# EasyEDA Pro project ATLAS.epro

# Schematic Atlas

## Sheets
1 Sheet_1: Board Name: Atlas; Create Date: 2026-04-08; Page Name: Sheet_1; Project Name: Atlas_2026-04-08_17-02-08; Schematic Name: Atlas; Update Date: 2026-04-08; Add into BOM: yes; Company: Your Company; Convert to PCB: yes; Date: 2026-01-27; Draw By: aryan17550; REV: 1.0; Sheet: 1/1; spicePre: .
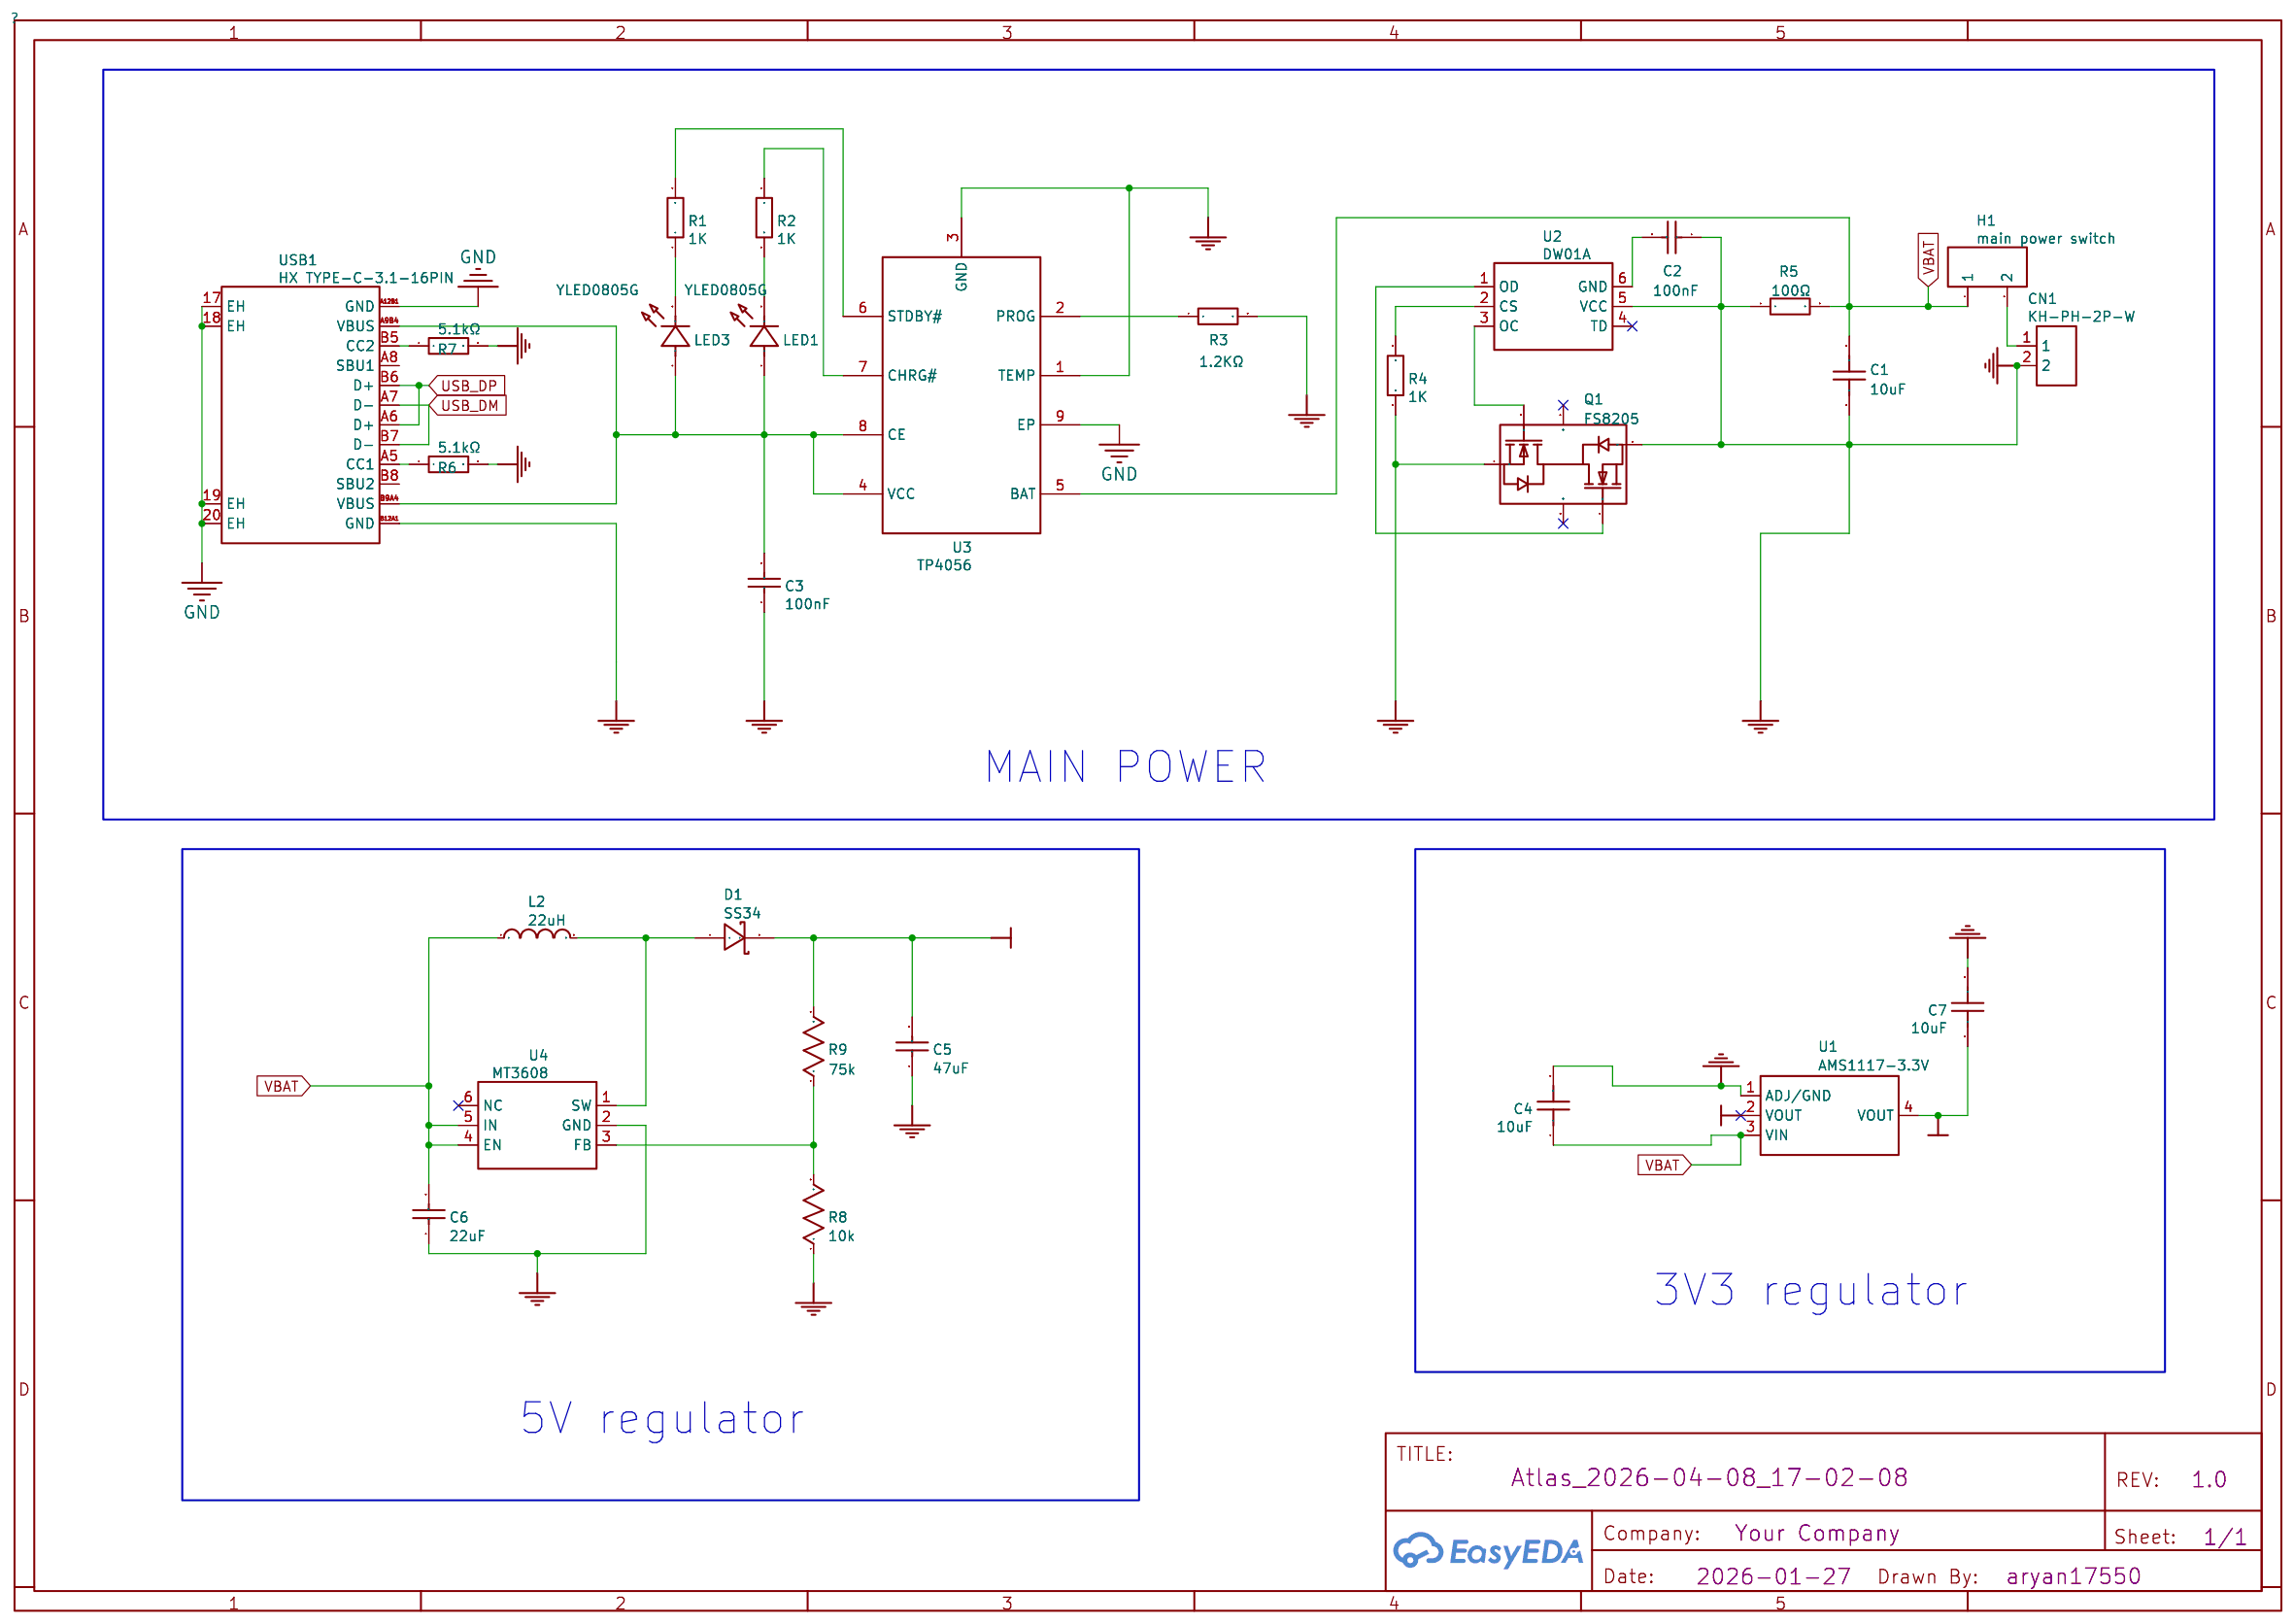
[diagram p0: Sheet_1]
2 Sheet_2: Page Name: Sheet_2; Update Date: 2026-04-09; Date: 2026-01-29
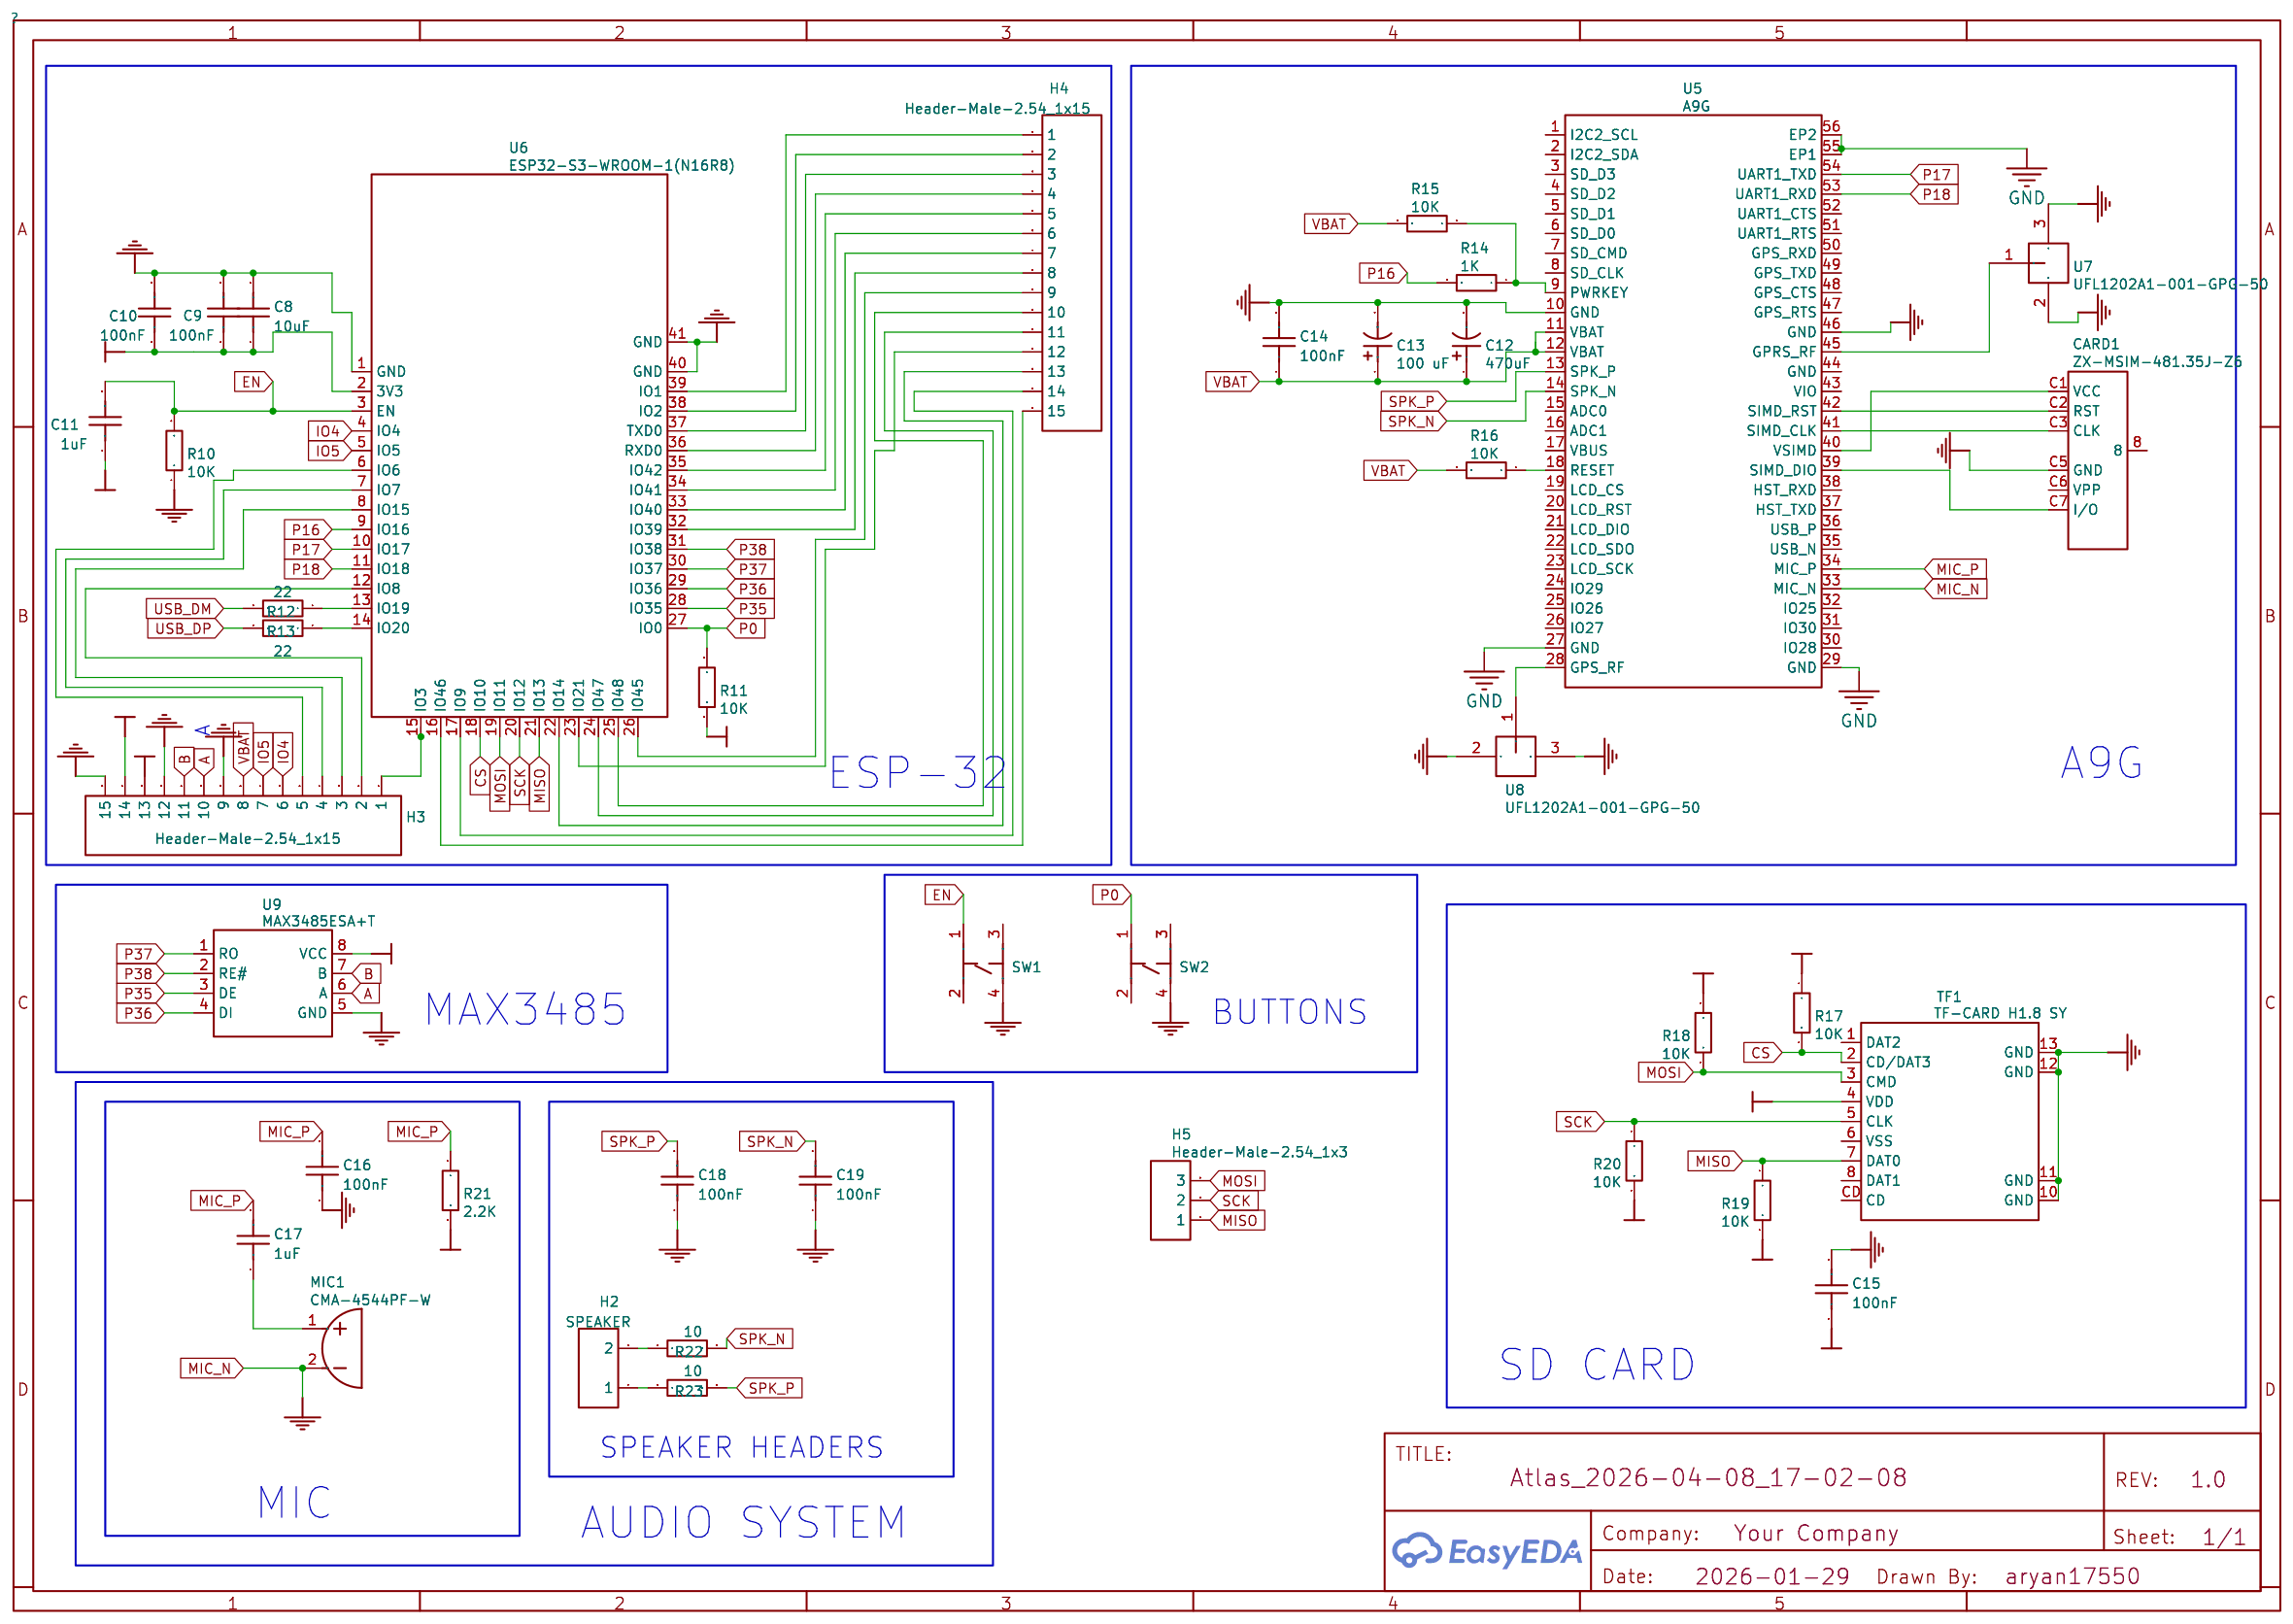
[diagram p1: Sheet_2]

## Parts
sheet Sheet_1
C1  10uF  [C0603]
C2  100nF  [C0603]
C3  100nF  [C0603]
C4  10uF  [C0603]
C5  47uF  [C0603]
C6  22uF  [C0603]
C7  10uF  [C0603]
CN1  KH-PH-2P-W  [CONN-TH_2P-P2.00_KINGHELM_KH-PH-2P-W]
D1  SS34  [SS34]
H1  main power switch  [HDR-TH_2P-P2.54-V-M-1]
L2  22uH  [IND-SMD_L12.5-W12.5_CYH125-22UH]
LED1  YLED0805G  [LED0805-FD-GREEN]
LED3  YLED0805G  [LED0805-FD-GREEN]
Q1  FS8205  [FS8205A]
R1  1K  [R0603]
R2  1K  [R0603]
R3  1.2KΩ  [R0603]
R4  1K  [R0603]
R5  100Ω  [R0603]
R6  5.1kΩ  [R0603]
R7  5.1kΩ  [R0603]
R8  10k  [R0603]
R9  75k  [R0603]
U1  AMS1117-3.3V  [SOT-223-4_L6.5-W3.5-P2.30-LS7.0-BR]
U2  DW01A  [DW01A]
U3  TP4056  [ESOP-8_L4.9-W3.9-P1.27-LS6.0-BL-EP]
U4  MT3608  [MT3608]
USB1  HX TYPE-C-3.1-16PIN  [TYPE-C-SMD_HX-TYPE-C-16PIN]
sheet Sheet_2
C8  10uF  [C0603]
C9  100nF  [C0603]
C10  100nF  [C0603]
C11  1uF  [C0603]
C12  470uF  [CAP-SMD_BD10.0-L10.3-W10.3-LS11.3-FD]
C13  100 uF  [CAP-SMD_BD10.0-L10.3-W10.3-LS11.3-FD]
C14  100nF  [C0603]
C15  100nF  [C0603]
C16  100nF  [C0603]
C17  1uF  [C0603]
C18  100nF  [C0603]
C19  100nF  [C0603]
CARD1  ZX-MSIM-481.35J-Z6  [SIM-SMD_ZX-MSIM-481.35J-Z6]
H2  SPEAKER  [HDR-TH_2P-P2.54-V-M-1]
H3  Header-Male-2.54_1x15  [HDR-TH_15P-P2.54-V-M]
H4  Header-Male-2.54_1x15  [HDR-TH_15P-P2.54-V-M]
H5  Header-Male-2.54_1x3  [HDR-TH_3P-P2.54-V-M-1]
MIC1  CMA-4544PF-W  [MIC-TH_BD9.7-P2.50-D0.8-L-FD]
R10  10K  [R0603]
R11  10K  [R0603]
R12  22  [R0603]
R13  22  [R0603]
R14  1K  [R0603]
R15  10K  [R0603]
R16  10K  [R0603]
R17  10K  [R0603]
R18  10K  [R0603]
R19  10K  [R0603]
R20  10K  [R0603]
R21  2.2K  [R0603]
R22  10  [R0603]
R23  10  [R0603]
SW1  HX-6X6X7.3-TP FT SQUARE BUTTON  [SW-SMD_4P-L6.0-W6.0-P4.50-LS9.0-H7.3]
SW2  HX-6X6X7.3-TP FT SQUARE BUTTON  [SW-SMD_4P-L6.0-W6.0-P4.50-LS9.0-H7.3]
TF1  TF-CARD H1.8 SY  [TF-SMD_TF-012]
U5  A9G  [GSM-SMD_A9-GSM-GPRSMODULE]
U6  ESP32-S3-WROOM-1(N16R8)  [WIRELM-SMD_ESP32-S3-WROOM-1]
U7  UFL1202A1-001-GPG-50  [IPEX-SMD_UFL1202A1-001-GPG-50]
U8  UFL1202A1-001-GPG-50  [IPEX-SMD_UFL1202A1-001-GPG-50]
U9  MAX3485ESA+T  [SOIC-8_L4.9-W3.9-P1.27-LS6.0-BL]

## Library data of the parts
C1 C4 C7 C8 = 10uF: Supplier: LCSC; Manufacturer: SAMSUNG; Manufacturer Part: CL10A106MP8NNNC; Supplier Part: C85713; nameAlias: Capacitance; spicePre: C; spiceSymbolName: CL10A106MP8NNNC
C2 C3 = 100nF: Supplier: LCSC; Manufacturer: WTC; Manufacturer Part: 0603B104K250; Supplier Part: C83054; nameAlias: Capacitance; spicePre: C; spiceSymbolName: 0603B104K250
C5 = 47uF: Supplier: LCSC; Manufacturer: FH; Manufacturer Part: 1812X226K250NT; Supplier Part: C28504; nameAlias: Capacitance; spicePre: C; spiceSymbolName: 1812X226K250NT
C6 = 22uF: Supplier: LCSC; Manufacturer: FH; Manufacturer Part: 1812X226K250NT; Supplier Part: C28504; nameAlias: Capacitance; spicePre: C; spiceSymbolName: 1812X226K250NT
CN1 = KH-PH-2P-W: Supplier: LCSC; Supplier Part: C2898954; Manufacturer: kinghelm(金航标); JLCPCB Part Class: Extended Part; Contributor: LCSC; spicePre: C
D1 = SS34: Supplier: LCSC; Manufacturer: MDD; image: //image.lceda.cn/szlcsc/C8678.jpg; Supplier Part: C8678; spicePre: D
H1 = main power switch: Supplier: LCSC; Manufacturer: TE Connectivity(泰科电子); Manufacturer Part: 826629-2; Supplier Part: C86471; JLCPCB Part Class: Extended Part; spicePre: H; spiceSymbolName: Header-Male-2.54_1x2
L2 = 22uH: Supplier: LCSC; Manufacturer: SXN(顺翔诺); Manufacturer Part: SMRH74-220MT; Supplier Part: C27442; JLCPCB Part Class: Extended Part; nameAlias: Value; spicePre: L; spiceSymbolName: SMRH74-220MT; Package Display: No
LED1 LED3 = YLED0805G: Supplier: LCSC; Supplier Part: C25170728; Manufacturer: YONGYUTAI(永裕泰); JLCPCB Part Class: Extended Part; Contributor: lcsc; spicePre: L
Q1 = FS8205: Supplier: LCSC; Manufacturer: FORTUNE; image: //image.lceda.cn/szlcsc/C32254.jpg; Supplier Part: C32254; LCSC Assembly: Yes; spicePre: Q
R1 R2 R4 R14 = 1K: Supplier: LCSC; Manufacturer: PANASONIC; Manufacturer Part: ERJ3GEYJ102V; Supplier Part: C180848; nameAlias: Resistance (Ohms); Contributor: LCSC; spicePre: R; spiceSymbolName: ERJ3GEYJ102V
R3 = 1.2KΩ: Supplier: LCSC; Manufacturer: YAGEO; Manufacturer Part: RC0603JR-071K2L; Supplier Part: C114679; nameAlias: Value; spicePre: R; spiceSymbolName: RC0603JR-071K2L
R5 = 100Ω: Supplier: LCSC; Manufacturer: UniOhm; Manufacturer Part: 0603WAJ0101T5E; Supplier Part: C25201; nameAlias: Value; spicePre: R; spiceSymbolName: 0603WAJ0101T5E
R6 R7 = 5.1kΩ: Supplier: LCSC; Supplier Part: C269716; Manufacturer: Tyohm(幸亚电阻); Manufacturer Part: RMC06035.1K1%N; JLCPCB Part Class: Extended Part; nameAlias: Value; Contributor: LCSC; spicePre: R; spiceSymbolName: RMC06035.1K1%N
R8 = 10k: Supplier: LCSC; Manufacturer: PANASONIC; Manufacturer Part: ?; Supplier Part: C180848; nameAlias: Value(Ω); spicePre: R; spiceSymbolName: Res_0603(1/10W)_US
R9 = 75k: Manufacturer Part: ?; nameAlias: Value(Ω); spicePre: R; spiceSymbolName: Res_0603(1/10W)_US
U1 = AMS1117-3.3V: Supplier: LCSC; Supplier Part: C2688239; Manufacturer: WPMtek(维攀); JLCPCB Part Class: Extended Part; Contributor: LCSC; spicePre: U
U2 = DW01A: Supplier: LCSC; Manufacturer: PUOLOP; Supplier Part: C351410; Contributor: LCSC; spicePre: U
U3 = TP4056: Supplier: LCSC; Manufacturer: TOPPOWER(南京拓微); Manufacturer Part: TP4056-42-ESOP8; Supplier Part: C16581; JLCPCB Part Class: Extended Part; Contributor: Guest; spicePre: U
U4 = MT3608: Supplier: LCSC; Manufacturer: AEROSEMI; Supplier Part: C84817; spicePre: U
USB1 = HX TYPE-C-3.1-16PIN: Supplier: LCSC; Supplier Part: C18357551; Manufacturer: hanxia(韩下); JLCPCB Part Class: Extended Part; Contributor: lcsc; spicePre: U
C9 C10 C14-C16 C18 C19 = 100nF: Supplier: LCSC; Manufacturer: SAMSUNG; Manufacturer Part: CL10A106MP8NNNC; Supplier Part: C85713; nameAlias: Capacitance; spicePre: C; spiceSymbolName: CL10A106MP8NNNC
C11 C17 = 1uF: Supplier: LCSC; Manufacturer: SAMSUNG; Manufacturer Part: CL10A106MP8NNNC; Supplier Part: C85713; nameAlias: Capacitance; spicePre: C; spiceSymbolName: CL10A106MP8NNNC
C12 = 470uF: Supplier: LCSC; Supplier Part: C5263875; Manufacturer: KNSCHA(科尼盛); Manufacturer Part: CS470UF35V167RV0136; JLCPCB Part Class: Extended Part; nameAlias: Value; Contributor: lcsc; spicePre: C; spiceSymbolName: CS470UF35V167RV0136
C13 = 100 uF: Supplier: LCSC; Supplier Part: C5263875; Manufacturer: KNSCHA(科尼盛); Manufacturer Part: CS470UF35V167RV0136; JLCPCB Part Class: Extended Part; nameAlias: Value; Contributor: lcsc; spicePre: C; spiceSymbolName: CS470UF35V167RV0136
CARD1 = ZX-MSIM-481.35J-Z6: Supplier: LCSC; Supplier Part: C7419932; Manufacturer: Megastar(兆星); JLCPCB Part Class: Extended Part; Contributor: lcsc; spicePre: C
H2 = SPEAKER: Supplier: LCSC; Manufacturer: TE Connectivity(泰科电子); Manufacturer Part: 826629-2; Supplier Part: C86471; JLCPCB Part Class: Extended Part; spicePre: H; spiceSymbolName: Header-Male-2.54_1x2
H3 H4 = Header-Male-2.54_1x15: Supplier: LCSC; Manufacturer: Ckmtw(灿科盟); Manufacturer Part: B-2100S15P-A110; Supplier Part: C124373; JLCPCB Part Class: Extended Part; Contributor: LCSC; spicePre: H
H5 = Header-Male-2.54_1x3: Supplier: LCSC; Manufacturer: BOOMELE(博穆精密); Manufacturer Part: 2.54-1*3P针; Supplier Part: C49257; JLCPCB Part Class: Extended Part; spicePre: H
MIC1 = CMA-4544PF-W: Supplier: LCSC; Supplier Part: C3273770; Manufacturer: CUI; JLCPCB Part Class: Extended Part; Contributor: lcsc; spicePre: M
R10 R11 R15-R20 = 10K: Supplier: LCSC; Manufacturer: PANASONIC; Manufacturer Part: ERJ3GEYJ102V; Supplier Part: C180848; nameAlias: Resistance (Ohms); Contributor: LCSC; spicePre: R; spiceSymbolName: ERJ3GEYJ102V
R12 R13 = 22: Supplier: LCSC; Manufacturer: PANASONIC; Manufacturer Part: ERJ3GEYJ102V; Supplier Part: C180848; nameAlias: Resistance (Ohms); Contributor: LCSC; spicePre: R; spiceSymbolName: ERJ3GEYJ102V
R21 = 2.2K: Supplier: LCSC; Manufacturer: PANASONIC; Manufacturer Part: ERJ3GEYJ102V; Supplier Part: C180848; nameAlias: Resistance (Ohms); Contributor: LCSC; spicePre: R; spiceSymbolName: ERJ3GEYJ102V
R22 R23 = 10: Supplier: LCSC; Manufacturer: PANASONIC; Manufacturer Part: ERJ3GEYJ102V; Supplier Part: C180848; nameAlias: Resistance (Ohms); Contributor: LCSC; spicePre: R; spiceSymbolName: ERJ3GEYJ102V
SW1 SW2 = HX-6X6X7.3-TP FT SQUARE BUTTON: Supplier: LCSC; Supplier Part: C49234152; Manufacturer: hanxia(韩下); Manufacturer Part: HX-6x6x7.3-TP FT square button; JLCPCB Part Class: Extended Part; Contributor: lcsc; spicePre: S
TF1 = TF-CARD H1.8 SY: Supplier: LCSC; Supplier Part: C7529391; Manufacturer: SHOU HAN(首韩); JLCPCB Part Class: Extended Part; Contributor: lcsc; spicePre: T
U5 = A9G: Supplier: LCSC; Supplier Part: C133738; Manufacturer: Ai-Thinker(安信可); JLCPCB Part Class: Extended Part; Contributor: lcsc; spicePre: U
U6 = ESP32-S3-WROOM-1(N16R8): Supplier: LCSC; Supplier Part: C2913202; Manufacturer: ESPRESSIF(乐鑫); Manufacturer Part: ESP32-S3-WROOM-1-N16R8; JLCPCB Part Class: Extended Part; Contributor: lcsc; spicePre: U
U7 U8 = UFL1202A1-001-GPG-50: Supplier: LCSC; Supplier Part: C22398248; Manufacturer: null; JLCPCB Part Class: Extended Part; Contributor: lcsc; spicePre: U
U9 = MAX3485ESA+T: Supplier: LCSC; Manufacturer: ADI(亚德诺)/MAXIM(美信); Supplier Part: C18148; JLCPCB Part Class: Extended Part; spicePre: U

## Nets
+3V3: C7.1 C8.1 C9.1 C10.1 C11.1 C15.1 H3.14 R11.1 R17.1 R18.1 R19.2 R20.2 R21.2 TF1.4(VDD) U1.2(VOUT) U1.4(VOUT) U6.2(3V3) U9.8(VCC)
+5V: C5.2 D1.2(K) H3.13 R9.2
GND: C1.1 C2.1 C3.1 C4.2 C5.1 C6.1 C7.2 C8.2 C9.2 C10.2 C12.2 C13.2 C14.2 C15.2 C16.1 C18.1 C19.1 CARD1.C5(GND) CN1.2 H3.9 H3.12 H3.15 MIC1.2 Q1.1(S1) Q1.3(S2) R3.2 R4.1 R5.1 R6.2 R7.2 R8.1 R10.1 SW1.4(D) SW2.4(D) TF1.10(GND) TF1.11(GND) TF1.12(GND) TF1.13(GND) U1.1(ADJ/GND) U2.5(VCC) U3.1(TEMP) U3.3(GND) U3.9(EP) U4.2(GND) U5.10(GND) U5.27(GND) U5.29(GND) U5.33(MIC_N) U5.46(GND) U5.55(EP1) U5.56(EP2) U6.1(GND) U6.40(GND) U6.41(GND) U7.2 U7.3 U8.2 U8.3 U9.5(GND) USB1.17(EH) USB1.18(EH) USB1.19(EH) USB1.20(EH) USB1.A12B1(GND) USB1.B12A1(GND)
VBAT: C1.2 C4.1 C6.2 C12.1 C13.1 C14.1 H1.1 H3.8 L2.1 R5.2 R15.2 R16.2 U1.3(VIN) U3.5(BAT) U4.4(EN) U4.5(IN) U5.11(VBAT) U5.12(VBAT)
A: H3.10 U9.6(A)
B: H3.11 U9.7(B)
CS: R17.2 TF1.2(CD/DAT3) U6.18(IO10)
EN: C11.2 R10.2 SW1.1(A) U6.3(EN)
IO4: H3.6 U6.4(IO4)
IO5: H3.7 U6.5(IO5)
MIC_P: C16.2 C17.2 R21.1 U5.34(MIC_P)
MISO: H5.1 R19.1 TF1.7(DAT0) U6.21(IO13)
MOSI: H5.3 R18.2 TF1.3(CMD) U6.19(IO11)
P0: R11.2 SW2.1(A) U6.27(IO0)
P16: R14.2 U6.9(IO16)
P17: U5.54(UART1_TXD) U6.10(IO17)
P18: U5.53(UART1_RXD) U6.11(IO18)
P35: U6.28(IO35) U9.3(DE)
P36: U6.29(IO36) U9.4(DI)
P37: U6.30(IO37) U9.1(RO)
P38: U6.31(IO38) U9.2(RE#)
SCK: H5.2 R20.1 TF1.5(CLK) U6.20(IO12)
SPK_N: C19.2 R22.2 U5.14(SPK_N)
SPK_P: C18.2 R23.2 U5.13(SPK_P)
USB_DM: R12.2 USB1.A7(D-) USB1.B7(D-)
USB_DP: R13.2 USB1.A6(D+) USB1.B6(D+)
$1N4: C2.2 U2.6(GND)
$1N5: Q1.4(G2) U2.1(OD)
$1N6: Q1.6(G1) U2.3(OC)
$1N8: R4.2 U2.2(CS)
$1N10: R3.1 U3.2(PROG)
$1N12: C3.2 LED1.1(A) LED3.1(A) U3.4(VCC) U3.8(CE) USB1.A9B4(VBUS) USB1.B9A4(VBUS)
$1N13: R1.2 U3.6(STDBY#)
$1N14: R2.1 U3.7(CHRG#)
$1N16: LED1.2(K) R2.2
$1N18: LED3.2(K) R1.1
$1N21: R6.1 USB1.A5(CC1)
$1N22: R7.1 USB1.B5(CC2)
$1N31: R8.2 R9.1 U4.3(FB)
$1N32: D1.1(A) L2.2 U4.1(SW)
$1N39: CN1.1 H1.2
$2N11: R12.1 U6.13(IO19)
$2N13: R13.1 U6.14(IO20)
$2N21: R14.1 R15.1 U5.9(PWRKEY)
$2N23: R16.1 U5.18(RESET)
$2N25: CARD1.C2(RST) U5.42(SIMD_RST)
$2N26: CARD1.C3(CLK) U5.41(SIMD_CLK)
$2N27: CARD1.C7(I/O) U5.39(SIMD_DIO)
$2N29: CARD1.C1(VCC) U5.40(VSIMD)
$2N30: U5.45(GPRS_RF) U7.1
$2N33: U5.28(GPS_RF) U8.1
$2N45: C17.1 MIC1.1
$2N53: H2.2 R22.1
$2N54: H2.1 R23.1
$2N75: H4.1 U6.39(IO1)
$2N76: H4.2 U6.38(IO2)
$2N77: H4.3 U6.37(TXD0)
$2N78: H4.4 U6.36(RXD0)
$2N79: H4.5 U6.35(IO42)
$2N80: H4.6 U6.34(IO41)
$2N81: H4.7 U6.33(IO40)
$2N82: H4.8 U6.32(IO39)
$2N83: H4.9 U6.26(IO45)
$2N84: H4.10 U6.25(IO48)
$2N85: H4.11 U6.24(IO47)
$2N86: H4.12 U6.23(IO21)
$2N87: H4.13 U6.22(IO14)
$2N88: H4.14 U6.17(IO9)
$2N89: H4.15 U6.16(IO46)
$2N90: H3.1 U6.15(IO3)
$2N91: H3.2 U6.12(IO8)
$2N92: H3.3 U6.8(IO15)
$2N93: H3.4 U6.7(IO7)
$2N94: H3.5 U6.6(IO6)

Not connected (* = marked no-connect by the designer): CARD1 8 C6(VPP); Q1 2(D12)* 5(D12)*; SW1 2(B) 3(C); SW2 2(B) 3(C); TF1 1(DAT2) 6(VSS) 8(DAT1) CD; U2 4(TD)*; U4 6(NC)*; U5 1(I2C2_SCL) 2(I2C2_SDA) 3(SD_D3) 4(SD_D2) 5(SD_D1) 6(SD_D0) 7(SD_CMD) 8(SD_CLK) 15(ADC0) 16(ADC1) 17(VBUS) 19(LCD_CS) 20(LCD_RST) 21(LCD_DIO) 22(LCD_SDO) 23(LCD_SCK) 24(IO29) 25(IO26) 26(IO27) 30(IO28) 31(IO30) 32(IO25) 35(USB_N) 36(USB_P) 37(HST_TXD) 38(HST_RXD) 43(VIO) 44(GND) 47(GPS_RTS) 48(GPS_CTS) 49(GPS_TXD) 50(GPS_RXD) 51(UART1_RTS) 52(UART1_CTS); USB1 A8(SBU1) B8(SBU2)

## Notes on the sheets
sheet 1
- MAIN POWER
- 3V3 regulator
- 5V regulator
sheet 2
- A
- ESP-32
- A9G
- MAX3485
- BUTTONS
- SD CARD
- SPEAKER HEADERS
- MIC
- AUDIO SYSTEM

# Board PCB_Atlas
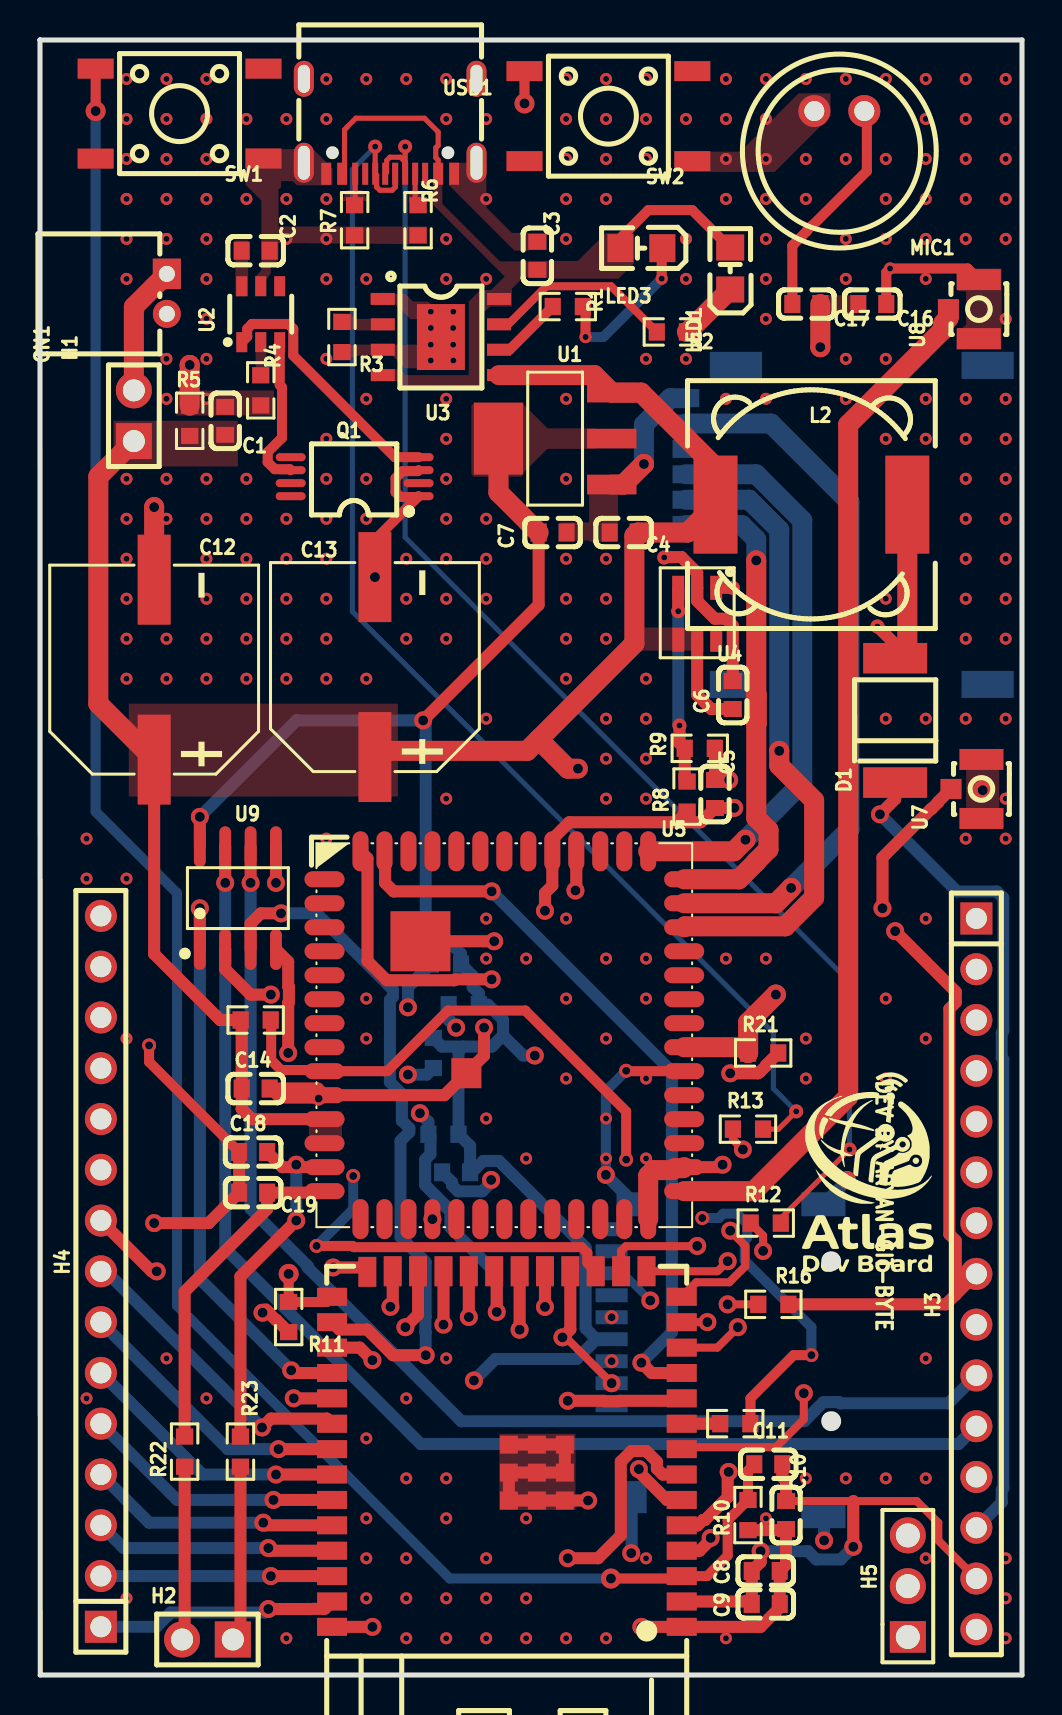
[diagram p2: board, top side]
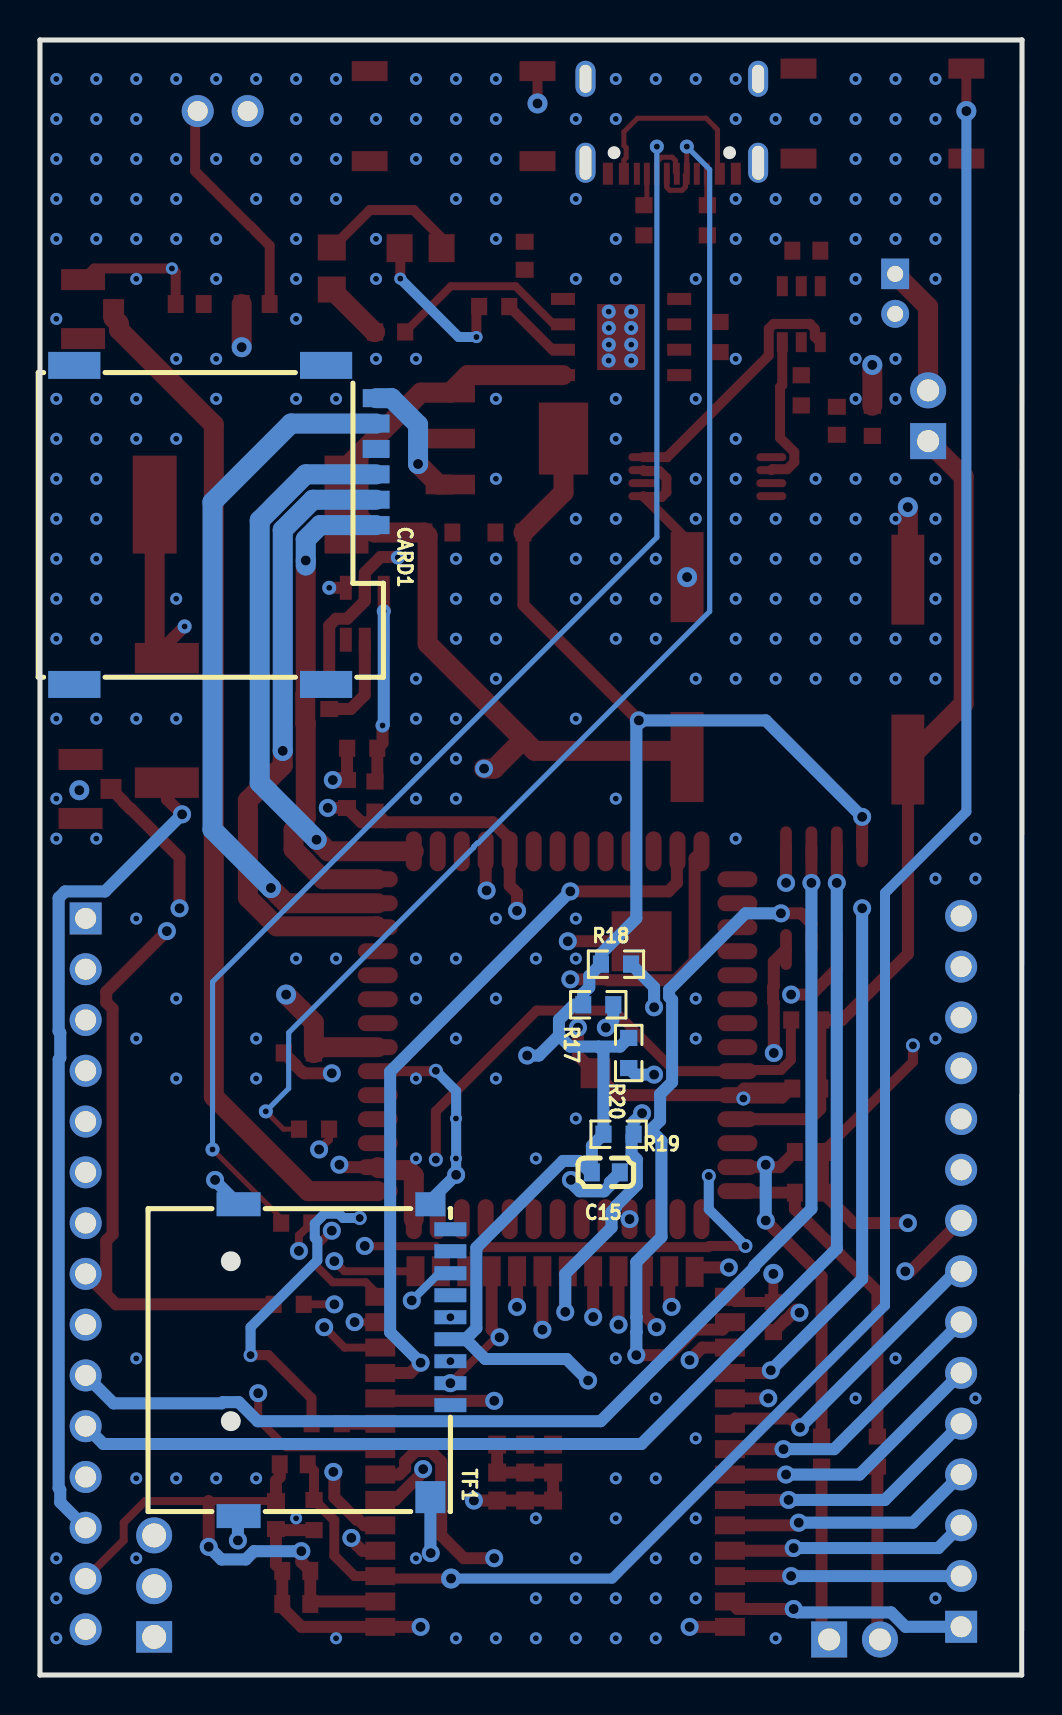
[diagram p3: board, bottom side, seen from below]

Outline 49.15 x 81.79 mm; copper layers: Top Layer, Inner1, Inner2, Bottom Layer. Coordinates in mm from the lower left corner of the outline.
Outline path: 0,81.79 49.15,81.79 49.15,0 0.02,0 0,81.79
Stack: Top Layer 0.035mm / Dielectric1 0.48mm PP er 4.5 / Inner1 0.035mm / Dielectric2 0.48mm FR4 er 4.5 / Inner2 0.035mm / Dielectric3 0.48mm PP er 4.5 / Bottom Layer 0.035mm

## Design rules (mm)
spacing Default (default): track to track 0.152, other pairs 0 to 0.152
spacing A9G: track to track 0.3, other pairs 0 to 0.3
spacing GND: track to track 0.152, other pairs 0 to 0.152
spacing Powe_3V3: track to track 0.2, other pairs 0 to 0.2
spacing Powe_VBAT: track to track 0.25, other pairs 0 to 0.25
spacing USB: track to track 0.15, other pairs 0 to 0.152
track width Default: min 0.254, default 0.254, max 25.4
track width A9G: min 1, default 1, max 25.4
track width GND: min 0.4, default 0.4, max 25.4
track width Powe_3V3: min 0.4, default 0.4, max 25.4
track width Powe_VBAT: min 0.6, default 0.6, max 25.4
track width USB (default): min 0.2, default 0.2, max 25.4
differential pair differentialPair (default): width min 0.127, default 0.254, max 2.54; gap min 0.152, default 0.152
via Default: diameter min 0.61, default 0.61, max 100.025; hole min 0.305, default 0.305, max 59.995
via A9G: diameter min 0.8, default 0.8, max 100.025; hole min 0.4, default 0.4, max 59.995
via GND (default): diameter min 0.6, default 0.6, max 100.025; hole min 0.3, default 0.3, max 59.995
via Powe_3V3: diameter min 0.8, default 0.8, max 100.025; hole min 0.4, default 0.4, max 59.995
via Powe_VBAT: diameter min 0.8, default 0.8, max 100.025; hole min 0.4, default 0.4, max 59.995
via USB: diameter min 0.62, default 0.62, max 100.025; hole min 0.305, default 0.305, max 59.995
net +3V3 uses Powe_3V3
net VBAT uses Powe_VBAT
net +5V uses Powe_VBAT
net USB_DP uses USB
net USB_DM uses USB
pour e42 uses GND

## Placement (name value [footprint] x y rotation side)
C1  10uF  [C0603]  9.27 62.74 270 top
C2  100nF  [C0603]  10.8 71.25 180 top
C3  100nF  [C0603]  24.89 70.99 270 top
C4  10uF  [C0603]  29.21 57.15 180 top
C5  47uF  [C0603]  33.78 44.07 90 top
C6  22uF  [C0603]  34.67 49.02 270 top
C7  10uF  [C0603]  25.65 57.15 0 top
C8  10uF  [C0603]  36.32 5.21 0 top
C9  100nF  [C0603]  36.32 3.56 0 top
C10  100nF  [C0603]  37.34 8 270 top
C11  1uF  [C0603]  36.45 10.54 180 top
C12  470uF  [CAP-SMD_BD10.0-L10.3-W10.3-LS11.3-FD]  5.71 50.29 90 top
C13  100 uF  [CAP-SMD_BD10.0-L10.3-W10.3-LS11.3-FD]  16.76 50.42 90 top
C14  100nF  [C0603]  10.8 29.34 0 top
C15  100nF  [C0603]  20.83 25.15 180 bottom
C16  100nF  [C0603]  41.66 68.58 180 top
C17  1uF  [C0603]  38.35 68.58 0 top
C18  100nF  [C0603]  10.67 26.16 0 top
C19  100nF  [C0603]  10.67 24.13 0 top
CARD1  ZX-MSIM-481.35J-Z6  [SIM-SMD_ZX-MSIM-481.35J-Z6]  39.88 57.53 270 bottom
CN1  KH-PH-2P-W  [CONN-TH_2P-P2.00_KINGHELM_KH-PH-2P-W]  6.35 69.09 270 top
D1  -  [SS34]  42.8 47.75 90 top
H1  main power switch  [HDR-TH_2P-P2.54-V-M-1]  4.7 62.99 90 top
H2  SPEAKER  [HDR-TH_2P-P2.54-V-M-1]  8.38 1.78 180 top
H3  Header-Male-2.54_1x15  [HDR-TH_15P-P2.54-V-M]  46.86 20.07 270 top
H4  Header-Male-2.54_1x15  [HDR-TH_15P-P2.54-V-M]  3.05 20.19 90 top
H5  Header-Male-2.54_1x3  [HDR-TH_3P-P2.54-V-M-1]  43.43 4.44 90 top
L2  22uH  [IND-SMD_L12.5-W12.5_CYH125-22UH]  38.61 58.55 0 top
LED1  YLED0805G  [LED0805-FD-GREEN]  34.54 70.36 270 top
LED3  YLED0805G  [LED0805-FD-GREEN]  30.1 71.37 0 top
MIC1  CMA-4544PF-W  [MIC-TH_BD9.7-P2.50-D0.8-L-FD]  40.01 78.23 180 top
Q1  FS8205  [FS8205A]  15.75 59.94 90 top
R1  1K  [R0603]  26.42 68.45 180 top
R2  1K  [R0603]  31.62 67.18 0 top
R3  1.2KΩ  [R0603]  15.11 66.93 270 top
R4  1K  [R0603]  11.05 64.26 90 top
R5  100Ω  [R0603]  7.49 62.74 270 top
R6  5.1kΩ  [R0603]  18.92 72.77 270 top
R7  5.1kΩ  [R0603]  15.75 72.77 270 top
R8  10k  [R0603]  32.39 43.94 90 top
R9  75k  [R0603]  33.02 46.36 0 top
R10  10K  [R0603]  35.43 8 90 top
R11  10K  [R0603]  12.45 17.91 90 top
R12  22  [R0603]  36.32 22.61 0 top
R13  22  [R0603]  35.43 27.3 0 top
R14  1K  [R0603]  34.8 12.57 180 top
R15  10K  [R0603]  10.8 32.77 180 top
R16  10K  [R0603]  36.7 18.54 0 top
R17  10K  [R0603]  21.21 33.53 180 bottom
R18  10K  [R0603]  20.32 35.56 180 bottom
R19  10K  [R0603]  20.19 27.05 0 bottom
R20  10K  [R0603]  19.68 31.11 90 bottom
R21  2.2K  [R0603]  36.2 31.11 0 top
R22  10  [R0603]  7.24 11.18 90 top
R23  10  [R0603]  10.03 11.18 90 top
SW1  HX-6X6X7.3-TP FT SQUARE BUTTON  [SW-SMD_4P-L6.0-W6.0-P4.50-LS9.0-H7.3]  6.99 78.11 0 top
SW2  HX-6X6X7.3-TP FT SQUARE BUTTON  [SW-SMD_4P-L6.0-W6.0-P4.50-LS9.0-H7.3]  28.45 77.98 0 top
TF1  TF-CARD H1.8 SY  [TF-SMD_TF-012]  33.91 15.75 270 bottom
U1  AMS1117-3.3V  [SOT-223-4_L6.5-W3.5-P2.30-LS7.0-BR]  25.78 61.85 0 top
U2  -  [DW01A]  9.78 67.31 90 top
U3  TP4056  [ESOP-8_L4.9-W3.9-P1.27-LS6.0-BL-EP]  20.07 66.93 270 top
U4  -  [MT3608]  32.89 53.09 270 top
U5  A9G  [GSM-SMD_A9-GSM-GPRSMODULE]  23.24 32 0 top
U6  ESP32-S3-WROOM-1(N16R8)  [WIRELM-SMD_ESP32-S3-WROOM-1]  23.37 11.3 180 top
U7  UFL1202A1-001-GPG-50  [IPEX-SMD_UFL1202A1-001-GPG-50]  46.36 44.32 0 top
U8  UFL1202A1-001-GPG-50  [IPEX-SMD_UFL1202A1-001-GPG-50]  46.23 68.33 0 top
U9  MAX3485ESA+T  [SOIC-8_L4.9-W3.9-P1.27-LS6.0-BL]  9.91 38.86 0 top
USB1  HX TYPE-C-3.1-16PIN  [TYPE-C-SMD_HX-TYPE-C-16PIN]  17.53 77.47 180 top

## Footprints (pads in the part's own frame, mm; a bottom-side part is the same pattern mirrored in y, then rotated)
C0603
  rect 0.8x0.9 smd: 1(-0.7,0) 2(0.7,0)
CAP-SMD_BD10.0-L10.3-W10.3-LS11.3-FD
  rect 4.5x1.65 smd: 1(-4.5,0) 2(4.5,0)
CONN-TH_2P-P2.00_KINGHELM_KH-PH-2P-W
  rect 1.524x1.4 hole 0.8: 1(-1,0)
  round 1.4 hole 0.8: 2(1,0)
DW01A
  rect 1x0.55 smd: 1(-0.638,-0.32) 2(-0.638,-1.27) 3(-0.638,-2.22) 4(2.162,-2.22) 5(2.162,-1.27) 6(2.162,-0.32)
ESOP-8_L4.9-W3.9-P1.27-LS6.0-BL-EP
  rect 0.6x1.2 smd: 1(-1.905,-2.909) 2(-0.635,-2.909) 3(0.635,-2.909) 4(1.905,-2.909) 5(1.905,2.909) 6(0.635,2.909) 7(-0.635,2.909) 8(-1.905,2.909)
  rect 3.3x2.4 smd: 9(0,0)
FS8205A
  oval 0.4x1.5 smd: 1(-0.976,-3.2) 2(-0.325,-3.2) 3(0.325,-3.2) 4(0.976,-3.2) 5(0.976,3.2) 6(0.325,3.2) 7(-0.325,3.2) 8(-0.976,3.2)
GSM-SMD_A9-GSM-GPRSMODULE
  oval 2x0.8 smd: 1(-9,7.8) 2(-9,6.6) 3(-9,5.4) 4(-9,4.2) 5(-9,2.999) 6(-9,1.8) 7(-9,0.6) 8(-9,-0.6) 9(-9,-1.8) 10(-9,-3) 11(-9,-4.2) 12(-9,-5.401) 13(-9,-6.6) 14(-9,-7.8) 28(9,-7.8) 29(9,-6.6) 30(9,-5.401) 31(9,-4.2) 32(9,-3) 33(9,-1.8) 34(9,-0.6) 35(9,0.6) 36(9,1.8) 37(9,2.999) 38(9,4.2) 39(9,5.4) 40(9,6.6) 41(9,7.8)
  oval 0.8x2 smd: 15(-7.2,-9.2) 16(-6,-9.2) 17(-4.8,-9.2) 18(-3.6,-9.2) 19(-2.4,-9.2) 20(-1.2,-9.2) 21(0,-9.2) 22(1.2,-9.2) 23(2.4,-9.2) 24(3.6,-9.2) 25(4.8,-9.2) 26(6,-9.2) 27(7.2,-9.2) 42(7.2,9.2) 43(6,9.2) 44(4.8,9.2) 45(3.6,9.2) 46(2.4,9.2) 47(1.2,9.2) 48(0,9.2) 49(-1.2,9.2) 50(-2.4,9.2) 51(-3.6,9.2) 52(-4.8,9.2) 53(-6,9.2) 54(-7.2,9.2)
  rect 3x3 smd: 55(-4.2,4.7)
  rect 1.5x1.5 smd: 56(-1.9,-1.9)
HDR-TH_2P-P2.54-V-M-1
  rect 1.8x1.8 hole 1.1: 1(-1.27,0)
  round 1.8 hole 1.1: 2(1.27,0)
HDR-TH_3P-P2.54-V-M-1
  rect 1.575x1.8 hole 1.2: 1(-2.54,0)
  round 1.8 hole 1.2: 2(0,0) 3(2.54,0)
HDR-TH_15P-P2.54-V-M
  rect 1.6x1.6 hole 1.05: 1(-17.78,0)
  round 1.6 hole 1.05: 2(-15.24,0) 3(-12.7,0) 4(-10.16,0) 5(-7.62,0) 6(-5.08,0) 7(-2.54,0) 8(0,0) 9(2.54,0) 10(5.08,0) 11(7.62,0) 12(10.16,0) 13(12.7,0) 14(15.24,0) 15(17.78,0)
IND-SMD_L12.5-W12.5_CYH125-22UH
  rect 2.2x4.9 smd: 1(-4.8,0) 2(4.8,0)
IPEX-SMD_UFL1202A1-001-GPG-50
  rect 1.05x1 smd: 1(-0.762,0)
  rect 2.2x1.05 smd: 2(0.762,-1.475) 3(0.762,1.475)
LED0805-FD-GREEN
  rect 1.3x1.399 smd: 1(-1.05,0) 2(1.05,0)
MIC-TH_BD9.7-P2.50-D0.8-L-FD
  round 1.6 hole 1: 1(-1.25,0) 2(1.25,0)
MT3608
  rect 1.2x0.6 smd: 1(-1.3,0.95) 2(-1.3,0) 3(-1.3,-0.95) 4(1.3,-0.95) 5(1.3,0) 6(1.3,0.95)
R0603
  rect 0.806x0.864 smd: 1(-0.753,0) 2(0.753,0)
SIM-SMD_ZX-MSIM-481.35J-Z6
  rect 1.35x2.61 smd: 8(-7.98,-7.553) 8(-7.98,5.048) 8(7.98,-7.552) 8(7.98,5.048)
  rect 0.9x1.34 smd: C1(-5.07,7.553) C2(-2.53,7.553) C3(0.01,7.553) C5(-6.34,7.553) C6(-3.8,7.553) C7(-1.26,7.553)
SOIC-8_L4.9-W3.9-P1.27-LS6.0-BL
  oval 0.588x2.045 smd: 1(-1.905,-2.57) 2(-0.635,-2.57) 3(0.635,-2.57) 4(1.905,-2.57) 5(1.905,2.57) 6(0.635,2.57) 7(-0.635,2.57) 8(-1.905,2.57)
SOT-223-4_L6.5-W3.5-P2.30-LS7.0-BR
  rect 2.47x0.98 smd: 1(2.835,-2.3) 2(2.835,0) 3(2.835,2.3)
  rect 2.47x3.6 smd: 4(-2.835,0)
SS34
  rect 1.524x3.2 smd: 1(3.111,0) 2(-3.111,0)
SW-SMD_4P-L6.0-W6.0-P4.50-LS9.0-H7.3
  rect 1.8x1 smd: 1(-4.2,2.25) 2(4.2,2.25) 3(-4.2,-2.25) 4(4.2,-2.25)
TF-SMD_TF-012
  rect 0.7x1.6 smd: 1(2.25,5.3) 2(1.15,5.3) 3(0.05,5.3) 4(-1.05,5.3) 5(-2.15,5.3) 6(-3.25,5.3) 7(-4.35,5.3) 8(-5.45,5.3) CD(-6.55,5.3)
  rect 1.2x1.5 smd: 10(-7.8,4.3)
  rect 1.2x2.2 smd: 11(-7.8,-5.3) 12(7.8,-5.3)
  rect 1.6x1.5 smd: 13(6.85,4.3)
TYPE-C-SMD_HX-TYPE-C-16PIN
  oval 1x2 hole 0.6x1.7: 17(-4.32,1.825) 20(4.32,1.825)
  oval 1x1.8 hole 0.6x1.4: 18(-4.32,-2.376) 19(4.32,-2.376)
  rect 0.3x1.1 smd: A5(-1.25,2.374) A6(-0.25,2.374) A7(0.25,2.374) A8(1.25,2.376) B5(1.75,2.374) B6(0.75,2.374) B7(-0.75,2.374) B8(-1.75,2.376)
  rect 0.5x1.1 smd: A9B4(2.4,2.375) A12B1(3.2,2.375) B9A4(-2.4,2.375) B12A1(-3.2,2.375)
WIRELM-SMD_ESP32-S3-WROOM-1
  rect 1.5x0.9 smd: 1(-8.75,8.895) 2(-8.75,7.625) 3(-8.75,6.355) 4(-8.75,5.085) 5(-8.75,3.815) 6(-8.75,2.545) 7(-8.75,1.275) 8(-8.75,0.005) 9(-8.75,-1.265) 10(-8.75,-2.535) 11(-8.75,-3.805) 12(-8.75,-5.075) 13(-8.75,-6.345) 14(-8.75,-7.615) 27(8.75,-7.615) 28(8.75,-6.345) 29(8.75,-5.075) 30(8.75,-3.805) 31(8.75,-2.535) 32(8.75,-1.265) 33(8.75,0.005) 34(8.75,1.275) 35(8.75,2.545) 36(8.75,3.815) 37(8.75,5.085) 38(8.75,6.355) 39(8.75,7.625) 40(8.75,8.895)
  rect 0.9x1.5 smd: 15(-6.985,-8.895) 16(-5.715,-8.895) 17(-4.445,-8.895) 18(-3.175,-8.895) 19(-1.905,-8.895) 20(-0.635,-8.895) 21(0.635,-8.895) 22(1.905,-8.895) 23(3.175,-8.895) 24(4.445,-8.895) 25(5.715,-8.895) 26(6.985,-8.865)
  rect 0.9x0.9 smd: 41(-2.9,2.575) 41(-2.9,1.175) 41(-2.9,-0.225) 41(-1.5,2.575) 41(-1.5,1.175) 41(-1.5,-0.226) 41(-0.1,2.575) 41(-0.1,1.175) 41(-0.1,-0.225)

## Nets
As in the schematic.

Pads without a net: CARD1 8 C6; Q1 2 5 7 8; SW1 2 3; SW2 2 3; TF1 1 6 8 CD; U2 4; U4 6; U5 1 2 3 4 5 6 7 8 15 16 17 19 20 21 22 23 24 25 26 30 31 32 35 36 37 38 43 44 47 48 49 50 51 52; USB1 A8 B8

## Via types
v1: diameter 0.9, hole 0.5, Top Layer to Bottom Layer, 83 vias
v2: diameter 0.7, hole 0.305, Top Layer to Bottom Layer, 4 vias
v3: diameter 1, hole 0.5, Top Layer to Bottom Layer, 15 vias
v4: diameter 0.7, hole 0.3, Top Layer to Bottom Layer, 13 vias
v5: diameter 0.6, hole 0.3, Top Layer to Bottom Layer, 268 vias
v6: diameter 0.7, hole 0.4, Top Layer to Bottom Layer, 10 vias
v7: diameter 0.61, hole 0.305, Top Layer to Bottom Layer, 3 vias

## Routing (per net, layer and track width the routed paths; a pad name or vN(x,y) marks a point on that pad's centre or on a via; arc(x,y) is an arc through that point)
+3V3: length 164.9
  Top Layer w0.4: H3.14 44.96,6.73 44.96,7.62 43.88,8.7 C10.1
  Top Layer w0.6: R21.2 36.35,30.51 36.35,30.48 36.05,30.18 36.02,30.18 35.93,30.1 v1(34.54,30.1) ; v1(8,42.93) 8,41.43 ; C11.1 37.15,9.91 37.34,9.72 C10.1 ; 36.07,6.22 36.07,5.65 C8.1 C9.1 35.5,3.68 U6.2 ; v1(40.7,6.41) 40.7,8.69 40.71,8.7 ; 11.51,18.09 11.31,18.29 ; v1(19.18,47.75) 24.95,53.53 C7.1 ; R11.1 11.84,17.76 11.81,17.76 11.51,18.05
  Top Layer w1: C7.1 22.95,59.16 22.95,61.85
  Inner1 w0.6: v1(11.14,18.12) 12.92,18.12 16.24,14.8 21.65,14.8 v1(21.72,14.73) 21.72,8.25 25.91,4.06 27.92,4.06 28.16,3.83 28.99,3.83 29.23,4.06 38.35,4.06 v1(40.7,6.41)
  Inner2 w0.4: v1(24.77,30.99) 33.65,30.99 v1(34.54,30.1)
  Bottom Layer w0.6: v1(21.72,14.73) 22.79,15.81 26.86,15.81 27.85,16.8 ; 27.85,16.8 27.31,17.34 27.31,21.38 22.97,25.72 22.18,25.72 21.62,25.15 C15.1 21.53,26.47 R19.2 20.95,31.19 21.19,31.44 ; 27.85,16.8 TF1.4 ; 23.17,31.99 24.18,30.99 v1(24.77,30.99) ; 23.17,31.99 22.62,31.44 21.19,31.44 ; 23.17,31.99 23.17,32.78 22.43,33.53 R17.1 21.96,34.1 21.66,34.4 21.66,34.98 R18.1 21.07,36.08 19.3,37.85 19.3,47.62 v1(19.18,47.75) 12.83,47.75 v1(8,42.93) ; 21.19,31.44 20.12,31.44 R20.2 ; v1(40.7,6.41) 40.07,5.78 38.85,5.78 38.44,6.19 v1(36.07,6.19)
+5V: length 52.5
  Top Layer w0.6: D1.2 42.8,43.81 v1(42.04,43.05) ; v1(34.49,44.77) C5.2 33.78,46.35 R9.2
  Inner1 w0.6: v1(34.49,44.77) 40.32,44.77 v1(42.04,43.05)
  Bottom Layer w0.6: 46.86,7.37 48.13,8.64 48.13,9.27 48.21,9.35 48.21,30.78 48.13,30.86 48.13,32.13 48.21,32.21 48.21,38.87 47.89,39.2 45.89,39.2 v1(42.04,43.05)
GND: length 138.4
  Top Layer w0.5: v3(16.76,54.92) 16.76,56.78 18.91,58.93 ; U8.3 46.43,70.36 v7(42.55,70.36) 42.36,70.17 C16.1 ; 18.91,58.93 Q1.1 ; 18.91,58.93 18.03,58.93 17.8,59.17 17.8,59.87 18.15,60.22 18.9,60.22 Q1.3 ; C14.2 11.99,28.84 v6(13.95,28.84) ; U5.33 29.36,30.2 v6(29.34,30.23) ; v6(5.46,31.5) 5.46,30.67 C18.1
  Top Layer w0.6: R8.1 31.85,42.66 ; 31.85,42.66 33.07,42.66 C5.1 33.79,43.38 v1(34.74,43.38) ; 31.85,42.66 26.49,42.66 25.64,41.81 U5.46 25.64,39.48 25.27,39.12 v1(25.27,38.23) ; R10.1 37.28,7.25 C10.2 37.34,5.52 37.02,5.21 37.02,3.37 36.06,2.41 U6.1 v1(30.1,2.41) ; U6.41 U6.41 U6.41 U6.41 U6.41 U6.41 U6.41 U6.41 U6.41 v1(27.43,8.73) ; 31.24,55.92 32.1,55.92 32.89,55.13 U4.2 32.89,53.72 33.78,52.84 34.33,52.84 34.67,52.5 C6.1 ; v1(34.16,25.53) 34.04,25.4 U5.29 ; C18.1 C19.1 8.44,22.61 v1(5.71,22.61) ; U6.40 v1(16.64,2.41) ; 11.81,41.43 v1(11.81,39.62) ; C14.2 13.91,29.34 U5.10 20.24,29 U5.56 22.23,30.99 v1(22.23,32.39) ; U5.55 v1(22.73,36.7)
  Top Layer w1: C12.2 v3(5.71,58.42) ; U5.29 32.19,25.36 31.76,25.36 31.66,25.26 30.72,25.26 30.44,24.98 U5.27 ; v3(30.23,60.58) 29.2,59.55 U1.1 ; R5.1 v3(7.49,65.53)
  Bottom Layer w0.5: v1(28.32,25.02) 28.32,29.21 v6(29.34,30.23)
  Bottom Layer w0.6: v1(39.24,6.73) 39.24,7.91 39.21,7.95 ; 29.61,23.55 29.61,23.73 v1(28.32,25.02) ; v1(29.59,6.1) 29.61,6.11 TF1.13 ; 39.21,23.55 40.39,24.72 v1(40.39,24.77) ; C15.2 20.63,24.65 20.63,24.49 20.92,24.2 22.14,24.2 22.43,24.49 22.43,24.61 v1(22.58,24.77)
  Bottom Layer w1: CARD1.C5 31.55,63.87 30.23,62.54 v3(30.23,60.58)
  vias: v3(47.18,44.26) v4(19.56,68.2) v4(19.56,67.38) v4(19.56,66.55) v4(19.56,65.75) v4(20.68,68.2) v4(20.68,67.38) v4(20.68,66.55) v4(20.69,65.75) v4(31.24,55.9) v5(2.33,41.84) v5(2.33,39.84) v5(2.33,13.84) v5(4.33,79.84) v5(4.33,77.84) v5(4.33,75.84) v5(4.33,73.84) v5(4.33,71.84) v5(4.33,69.84) v5(4.33,59.84) v5(4.33,57.84) v5(4.33,55.84) v5(4.33,53.84) v5(4.33,51.84) v5(4.33,49.84) v5(4.33,39.84) v5(4.33,31.84) v5(4.33,3.84) v5(6.33,79.84) v5(6.33,77.84) v5(6.33,75.84) v5(6.33,73.84) v5(6.33,71.84) v5(6.33,65.84) v5(6.33,63.84) v5(6.33,59.84) v5(6.33,57.84) v5(6.33,51.84) v5(6.33,49.84) v5(6.33,15.84) v5(8.33,79.84) v5(8.33,77.84) v5(8.33,75.84) v5(8.33,73.84) v5(8.33,71.84) v5(8.33,69.84) v5(8.33,67.84) v5(8.33,65.84) v5(8.33,63.84) v5(8.33,59.84) v5(8.33,57.84) v5(8.33,55.84) v5(8.33,53.84) v5(8.33,51.84) v5(8.33,49.84) v5(8.33,13.84) v5(10.33,77.84) v5(10.33,73.84) v5(10.33,59.84) v5(10.33,57.84) v5(10.33,55.84) v5(10.33,53.84) v5(10.33,51.84) v5(10.33,49.84) v5(12.33,77.84) v5(12.33,73.84) v5(12.33,71.84) v5(12.33,57.84) v5(12.33,55.84) v5(12.33,53.84) v5(12.33,51.84) v5(12.33,49.84) v5(12.33,1.84) v5(14.33,79.84) v5(14.33,77.84) v5(14.33,73.84) v5(14.33,71.84) v5(14.33,69.84) v5(14.33,65.84) v5(14.33,61.84) v5(14.33,59.84) v5(14.33,57.84) v5(14.33,55.84) v5(14.33,53.84) v5(14.33,51.84) v5(14.33,49.84) v5(14.33,41.84) v5(16.33,79.84) v5(16.33,69.84) v5(16.33,63.84) v5(16.33,59.84) v5(16.33,57.84) v5(16.33,49.84) v5(16.33,33.84) v5(16.33,31.84) v5(16.33,11.84) v5(16.33,7.84) v5(16.33,5.84) v5(16.33,3.84) v5(18.33,79.84) v5(18.33,55.84) v5(18.33,53.84) v5(18.33,51.84) v5(18.33,13.84) v5(18.33,9.84) v5(18.33,5.84) v5(18.33,3.84) v5(18.33,1.84) v5(20.33,79.84) v5(20.33,77.84) v5(20.33,71.84) v5(20.33,69.84) v5(20.33,63.84) v5(20.33,61.84) v5(20.33,59.84) v5(20.33,57.84) v5(20.33,55.84) v5(20.33,53.84) v5(20.33,51.84) v5(20.33,43.84) v5(20.33,15.84) v5(20.33,9.84) v5(20.33,7.84) v5(20.33,3.84) v5(20.33,1.84) v5(22.33,77.84) v5(22.33,73.84) v5(22.33,69.84) v5(22.33,57.84) v5(22.33,55.84) v5(22.33,53.84) v5(22.33,47.84) v5(22.33,37.84) v5(22.33,35.84) v5(22.33,27.84) v5(22.33,5.84) v5(22.33,3.84) v5(22.33,1.84) v5(24.33,35.84) v5(24.33,25.84) v5(24.33,7.84) v5(24.33,3.84) v5(24.33,1.84) v5(26.33,79.84) v5(26.33,77.84) v5(26.33,75.84) v5(26.33,73.84) v5(26.33,71.84) v5(26.33,63.84) v5(26.33,59.84) v5(26.33,55.84) v5(26.33,53.84) v5(26.33,51.84) v5(26.33,49.84) v5(26.33,37.84) v5(26.33,33.84) v5(26.33,29.84) v5(26.33,1.84) v5(28.33,79.84) v5(28.33,77.84) v5(28.33,75.84) v5(28.33,73.84) v5(28.33,55.84) v5(28.33,53.84) v5(28.33,51.84) v5(28.33,47.84) v5(28.33,45.84) v5(28.33,43.84) v5(28.33,35.84) v5(28.33,31.84) v5(28.33,27.84) v5(28.33,25.84) v5(28.33,1.84) v5(30.33,79.84) v5(30.33,77.84) v5(30.33,75.84) v5(30.33,65.84) v5(30.33,49.84) v5(30.33,47.84) v5(30.33,45.84) v5(30.33,43.84) v5(30.33,35.84) v5(30.33,33.84) v5(30.33,29.84) v5(30.33,25.84) v5(30.33,5.84) v5(32.33,77.84) v5(32.33,71.84) v5(32.33,69.84) v5(32.33,65.84) v5(34.33,79.84) v5(34.33,77.84) v5(34.33,75.84) v5(34.33,73.84) v5(34.33,63.84) v5(34.33,35.84) v5(34.33,1.84) v5(36.33,79.84) v5(36.33,77.84) v5(36.33,75.84) v5(36.33,73.84) v5(36.33,71.84) v5(36.33,69.84) v5(36.33,67.84) v5(36.33,63.84) v5(36.33,35.84) v5(36.33,7.84) v5(38.33,79.84) v5(38.33,75.84) v5(38.33,73.84) v5(38.33,31.84) v5(38.33,29.84) v5(38.33,9.84) v5(40.33,79.84) v5(40.33,75.84) v5(40.33,71.84) v5(40.33,69.84) v5(40.33,65.84) v5(40.33,63.84) v5(40.33,9.84) v5(42.33,79.84) v5(42.33,75.84) v5(42.33,73.84) v5(42.33,71.84) v5(42.33,65.84) v5(42.33,61.84) v5(42.33,53.84) v5(42.33,47.84) v5(42.33,33.84) v5(42.33,29.84) v5(42.33,9.84) v5(44.33,79.84) v5(44.33,77.84) v5(44.33,75.84) v5(44.33,73.84) v5(44.33,71.84) v5(44.33,69.84) v5(44.33,63.84) v5(44.33,61.84) v5(44.33,47.84) v5(44.33,37.84) v5(44.33,31.84) v5(44.33,15.84) v5(44.33,9.84) v5(44.33,5.84) v5(46.33,79.84) v5(46.33,77.84) v5(46.33,75.84) v5(46.33,73.84) v5(46.33,71.84) v5(46.33,63.84) v5(46.33,61.84) v5(46.33,59.84) v5(46.33,57.84) v5(46.33,55.84) v5(46.33,53.84) v5(46.33,51.84) v5(46.33,47.84) v5(46.33,41.84) v5(48.33,79.84) v5(48.33,77.84) v5(48.33,75.84) v5(48.33,73.84) v5(48.33,71.84) v5(48.33,67.84) v5(48.33,63.84) v5(48.33,61.84) v5(48.33,59.84) v5(48.33,57.84) v5(48.33,55.84) v5(48.33,53.84) v5(48.33,51.84) v5(48.33,47.84) v5(48.33,43.84) v5(48.33,41.84) v5(48.33,5.84) v5(48.33,3.84) v5(48.33,1.84)
VBAT: length 144.7
  Top Layer w0.6: 45.83,19.04 45.34,18.54 R16.2 ; 45.83,19.04 H3.8 ; 45.83,19.04 45.83,21.73 45.51,22.05 45.51,33.33 45.83,33.64 45.83,34.18 v1(42.8,37.21) ; C6.2 33.59,48.32 32.89,49.02 U4.5 ; C12.1 5.71,36.07 9.02,32.77 R15.2 10.1,32.71 C14.1 10.1,28.32 10.61,27.8 U5.11
  Top Layer w1: v1(26.92,45.34) 26.42,45.34 24.96,46.8 ; C13.1 17.07,46.23 24.38,46.23 24.96,46.8 ; 4.7,61.72 2.92,59.94 2.92,48.59 C12.1 ; 24.96,46.8 29.75,51.59 29.75,56.99 29.91,57.15 32.41,57.15 L2.1 33.81,60.43 30.08,64.15 U1.3 27.74,65.02 U3.5
  Inner2 w0.6: v1(26.92,45.34) 26.92,40.89 34.92,32.89 38.48,32.89 v1(42.8,37.21)
A: length 59.9
  Top Layer w0.6: 10.54,41.43 v1(10.54,39.62)
  Bottom Layer w0.6: H3.10 45.47,13.59 40.05,13.59 39.99,13.65 39.2,13.65 38.25,12.7 21.09,12.7 13.4,20.38 13.4,20.46 10.54,23.32 v1(10.54,39.62)
B: length 62.1
  Top Layer w0.6: 9.27,41.43 v1(9.27,39.62)
  Bottom Layer w0.6: H3.11 45.97,11.56 19.05,11.56 9.27,21.34 v1(9.27,39.62)
CS: length 26
  Top Layer w0.4: v1(28.61,14.6) 26.32,16.89 v1(26.15,16.89)
  Top Layer w0.6: U6.18 26.54,17.28 v1(26.15,16.89)
  Inner1 w0.6: v1(26.15,16.89) 26.15,18.02 26.17,18.04 26.17,27.16 21.86,31.48 21.85,31.48 21.32,32.01 21.32,32.02 20.95,32.39 v1(20.83,32.39)
  Bottom Layer w0.6: R17.2 20.46,32.76 v1(20.83,32.39)
EN: length 102.4
  Top Layer w0.5: C11.2 35.43,10.22 R10.2 34.42,7.74 34.42,5.97 33.4,4.95 U6.3 32,4.83 v3(28.58,4.83) ; 2.79,80.36 v3(2.79,78.23)
  Bottom Layer w0.5: v3(2.79,78.23) 2.79,43.19 6.86,39.12 6.86,18.48 20.51,4.83 v3(28.58,4.83)
IO4: length 27.8
  Top Layer w0.6: U6.4 33.02,6.22 33.65,6.86
  Inner2 w0.6: H3.6 41.93,20.21 41.93,16.52 38.6,13.19 34.91,13.19 33.57,11.85 v1(33.57,6.86)
IO5: length 24
  Top Layer w0.6: U6.5 32.92,7.49 33.19,7.76 33.29,7.76 34.42,8.89 34.42,10.16
  Inner2 w0.6: 46.86,22.61 46.86,22.56 42.68,18.37 42.68,14.43 39.99,11.75 36.05,11.75 v1(34.47,10.16)
MIC_P: length 42.3
  Top Layer w1: U5.34 35.15,31.4 R21.1 35.44,32.65 v3(36.83,34.04) ; C17.2 v3(39.05,66.42)
  Inner2 w1: v3(36.83,34.04) 39.05,36.26 v3(39.05,66.42)
MISO: length 56.1
  Top Layer w0.6: U6.21 22.86,20.07 v1(22.86,18.16)
  Inner1 w0.4: v1(22.86,18.16) 23.2,17.82 23.2,16.94 24.05,16.09 26.88,16.09 27.99,17.2 28.9,17.2 29.86,18.16 29.97,18.16 v1(30.54,18.73)
  Inner2 w0.4: v1(22.86,18.16) 22.86,14.43 35.39,1.91 H5.1
  Bottom Layer w0.4: TF1.7 29.18,20.1 v1(30.54,18.73)
  Bottom Layer w0.6: 18.92,28.19 19.44,27.68 R19.1 19.54,26.95 19.54,26.05 19.28,25.78 19.28,24.51 20.32,23.47 20.32,23.4 20.54,23.18 20.54,22.38 22.86,20.07 v1(22.86,18.16)
  vias: v1(19.02,28.1)
MOSI: length 54.8
  Top Layer w0.6: U6.19 v1(25.27,18.41)
  Inner1 w0.6: v1(25.27,18.41) 25.27,26.54 v1(18.42,33.4)
  Inner2 w0.4: H5.3 39.62,3.18 35.81,3.18 25.07,13.92 25.07,18.22 v1(25.27,18.41)
  Inner2 w0.5: 25.07,15.74 25.11,15.7 v6(28.61,15.7)
  Bottom Layer w0.6: R18.2 18.42,34.41 v1(18.42,33.4)
P0: length 70.7
  Top Layer w0.5: v3(12.45,20.07) R11.2 14.36,18.66 U6.27 ; SW2.1 v3(24.25,78.61)
  Inner1 w1: v3(12.45,20.07) 10.03,22.48 10.03,30.48 24.25,44.7 v3(24.25,78.61)
P16: length 1.9
  Top Layer w0.6: U6.9 34.04,12.57 R14.2
P17: length 45.6
  Top Layer w0.6: v1(22.61,34.8) 20.77,34.8 20.73,34.75 17.35,34.75 16.39,35.72 16.39,40.86 U5.54 ; U6.10 32,13.72 29,13.72 28.98,13.7 28.24,13.7 28.22,13.72 v1(26.42,13.72)
  Inner1 w0.5: v1(26.42,13.72) 27.05,14.35 27.05,15.4 28.24,16.59 29.15,16.59 30.11,17.56 30.22,17.56 30.54,17.88 30.9,17.88 31.4,18.38 31.4,26.01 v1(22.61,34.8)
P18: length 37.3
  Top Layer w0.6: U6.11 30.61,15.11 v1(30.1,15.62) ; U5.53 17.27,41.17 17.27,39.62 17.7,39.2 v1(22.61,39.2)
  Bottom Layer w0.6: v1(30.1,15.62) 31.62,17.14 31.62,30.18 v1(22.61,39.2)
P35: length 35
  Top Layer w0.6: U6.28 14.99,17.28 16.38,17.28 17.66,16 v1(19.3,16) ; U9.3 10.54,37.59 11.05,38.1 v1(12.07,38.1)
  Bottom Layer w0.6: v1(19.3,16) 19.3,17.14 19.29,17.15 19.29,17.9 19.3,17.91 19.3,20.65 18.04,21.91 18.04,26.72 18.48,27.16 18.48,27.36 18.11,27.73 18.11,29.06 17.51,29.66 17.51,33.77 17.66,33.92 17.66,34.28 13.84,38.1 v1(12.07,38.1)
P36: length 25.1
  Top Layer w0.6: v1(16.64,15.75) 16.01,16.38 U6.29 ; v1(12.42,31.11) 12.42,33.63 12.46,33.66 12.46,34.41 12.42,34.45 12.42,35.68 U9.4
  Inner1 w0.6: v1(12.42,31.11) 13.9,29.64 14.28,29.64 14.75,29.17 14.75,28.79 16.64,26.9 v1(16.64,15.75)
P37: length 29.2
  Top Layer w0.6: U9.1 v1(8,38.35) ; U6.30 12.7,15.11 v1(12.57,15.24)
  Bottom Layer w0.6: v1(8,38.35) 8,19.81 v1(12.57,15.24)
P38: length 33.3
  Top Layer w0.6: U9.2 9.27,35.31 10.54,34.04 v1(11.56,34.04) ; v1(12.7,13.84) 12.7,13.84 U6.31
  Inner1 w1: v1(12.7,13.84) 10.63,13.84 4.68,19.8 4.68,22.08 4.61,22.15 4.61,23.06 4.68,23.13 4.68,27.16 v1(11.56,34.04)
SCK: length 54.8
  Top Layer w0.6: U6.20 v1(24,17.27)
  Inner1 w0.6: v1(18.42,30.03) 18.86,30.03 24,24.89 v1(24,17.27)
  Inner2 w0.4: v1(24,17.27) 24,14.07 35.54,2.54 41.53,2.54 H5.2
  Inner2 w0.5: v6(28.61,17.9) 27.06,17.9 25.65,19.3 24.51,19.3 24,18.8 v1(24,17.27)
  Bottom Layer w0.6: v1(18.42,30.03) 19.36,30.03 R20.1
SPK_N: length 16.8
  Top Layer w0.6: U5.14 14.17,24.13 C19.2 11.37,23.31 7.24,19.18 R22.2
SPK_P: length 17.9
  Top Layer w0.6: U5.13 12.13,25.4 C18.2 ; R23.2 10.03,19.94 v1(12.83,22.73)
  Bottom Layer w0.6: v1(12.83,22.73) v1(12.83,25.53)
USB_DM: length 67.6
  Top Layer w0.254: v2(40.51,26.29) 37.08,22.85 R12.2 ; 18.28,75.69 v2(18.28,76.45) ; 18.28,75.69 18.04,75.92 17.51,75.92 17.35,75.76 17.35,75.17 USB1.A7 ; 18.28,75.69 USB1.B7
  Bottom Layer w0.254: v2(40.51,26.29) 40.51,34.67 18.28,56.91 v2(18.28,76.45)
USB_DP: length 63.8
  Top Layer w0.254: v2(16.78,76.45) USB1.B6 16.85,75.02 16.85,74.43 17.01,74.27 17.63,74.27 17.78,74.42 17.78,75.09 USB1.A6 ; R13.2 36.96,27.3 v2(37.85,28.19)
  Bottom Layer w0.254: v2(16.78,76.45) 15.63,75.31 15.63,53.2 27.22,41.61 27.27,41.61 27.43,41.45 27.43,41.4 36.7,32.13 36.7,29.34 v2(37.85,28.19)
$1N5: length 13
  Top Layer w0.5: U2.1 10.37,66.94 10.37,67.34 10.61,67.57 10.62,67.57 10.63,67.58 12.43,67.58 12.68,67.34 12.68,66.01 17.76,60.92 18.95,60.92
$1N6: length 7.7
  Top Layer w0.5: Q1.6 12.5,60.32 11.75,60.32 11.4,60.67 11.4,61.17 12.11,61.89 12.11,64.42 12,64.53 U2.3
$1N12: length 15.9
  Top Layer w0.254: 19.93,75.22 19.93,75.79 19.81,75.9 19.81,76.4 19.93,76.51 19.93,77.19 19.24,77.87 15.81,77.87 15.37,77.43 15.37,77.42 15.24,77.3 15.24,75.55
  Top Layer w0.5: LED1.1 34.51,71.41 32.64,73.28 30.45,73.28 29.05,71.88
$1N13: length 3.6
  Top Layer w0.5: R1.2 23.5,66.29 U3.6
$1N14: length 9.6
  Top Layer w0.4: U3.7 23.44,67.56 25.35,69.47 28.58,69.47 R2.1
$1N16: length 3
  Top Layer w1: R2.2 32.42,67.18 LED1.2
$1N18: length 8.1
  Top Layer w0.5: R1.1 27.3,68.32 v7(27.3,66.93) ; v7(31.11,69.85) 31.11,71.34 LED3.2
  Bottom Layer w0.5: v7(27.3,66.93) 28.19,66.93 v7(31.11,69.85)
$1N21: length 1.6
  Top Layer w0.254: R6.1 18.78,73.67 USB1.A5
$1N22: length 1.6
  Top Layer w0.254: R7.1 15.78,73.55 USB1.B5
$1N31: length 9.9
  Top Layer w0.6: v4(32,47.5) 32,46.62 R9.1 32.27,44.81 R8.2 ; U4.3 v4(31.94,53.21)
  Bottom Layer w0.6: v4(32,47.5) 31.94,47.56 v4(31.94,53.21)
$1N32: length 18.8
  Top Layer w0.6: v4(41.91,52.45) 42.8,51.56 D1.1 ; U4.1 v4(34.67,54.39)
  Top Layer w1: L2.2 43.41,51.47 D1.1
  Inner1 w0.6: v4(41.91,52.45) 39.98,54.39 v4(34.67,54.39)
$1N39: length 6.5
  Top Layer w1: H1.2 4.7,68.44 CN1.1
$2N11: length 8.3
  Top Layer w0.4: v1(33.4,17.65) 33.4,17.65 U6.13 ; v1(36.19,21.21) 36.19,21.98 R12.1
  Inner1 w0.5: v1(33.4,17.65) 33.57,17.82 33.57,18.89 34.06,19.39 35.14,19.39 36.19,20.44 v1(36.19,21.21)
$2N13: length 11.5
  Top Layer w0.4: U6.14 32.85,19.65 34.5,19.65 35.3,20.45 35.3,21.47 v1(34.54,22.22) ; R13.1 34.68,26.79 v1(35.18,26.29)
  Inner2 w0.5: v1(35.18,26.29) 35.18,22.86 v1(34.54,22.22)
$2N21: length 46.6
  Top Layer w0.5: R15.1 11.57,32.74 11.57,30.76 12.07,30.26 14.05,30.26 14.11,30.2 U5.9 17.38,30.2 20.41,33.24 24.29,33.24 29.34,28.19 v6(29.34,25.78) ; R14.1 35.56,12.58 35.56,13.84 37.72,16 v6(38.61,16)
  Inner2 w0.5: v6(29.34,25.78) 32.26,22.86 v6(33.15,22.86)
  Bottom Layer w0.5: v6(38.61,16) 38.61,17.4 35.27,20.74 35.27,21.75 35.4,21.87 35.4,22.58 34.9,23.08 34.19,23.08 33.97,22.86 v6(33.15,22.86)
$2N23: length 18.1
  Top Layer w0.4: R16.1 v1(34.42,18.54)
  Inner2 w0.4: v1(34.42,18.54) 32.89,20.07 22.38,20.07 v1(19.64,22.8)
$2N25: length 29
  Top Layer w1: v3(35.31,41.78) 34.73,41.2 U5.42
  Bottom Layer w1: CARD1.C2 35.85,60.06 38.15,57.76 38.15,44.63 v3(35.31,41.78)
$2N26: length 24.7
  Top Layer w1: U5.41 34.98,39.8 35.85,40.67 35.85,40.69 36.46,41.31 36.46,42.26 35.85,42.87 35.85,47.59 35.87,47.61 35.87,49.03 35.85,49.06 v3(35.85,55.75)
  Bottom Layer w1: CARD1.C3 35.13,57.52 35.85,56.8 35.85,55.5
$2N27: length 31.5
  Top Layer w1: U5.39 32.29,37.45 37.3,37.45 38.74,38.89 38.74,43.75 37,45.5 v3(37,46.23)
  Bottom Layer w1: CARD1.C7 35.49,58.79 37,57.28 v3(37,46.23)
$2N29: length 36
  Top Layer w1: U5.40 36.83,38.6 v3(37.59,39.37)
  Bottom Layer w1: CARD1.C1 36.59,62.6 40.51,58.67 40.51,42.29 v3(37.59,39.37)
$2N30: length 25.1
  Top Layer w0.6: U7.1 44.95,43.68 44.95,43.65 44.63,43.33 44.6,43.33 42.16,40.89 v1(42.16,38.35) ; U5.45 26.84,39.29 v1(26.8,39.24)
  Inner1 w0.6: v1(42.16,38.35) 27.69,38.35 v1(26.8,39.24)
$2N33: length 51.6
  Top Layer w1: U5.28 35.72,24.2 40.45,28.93 40.45,62.55 45.2,67.29 45.2,67.58 45.24,67.62 45.24,67.65 45.47,67.87 U8.1
$2N45: length 11.3
  Top Layer w0.5: MIC1.1 41.38,78.11 41.38,75.23 38.63,72.48 38.61,72.48 38.38,72.24 38.38,72.23 37.65,71.5 C17.1
$2N53: length 8.7
  Top Layer w0.6: H2.2 7.24,1.91 R22.1
$2N54: length 8.8
  Top Layer w0.6: R23.1 10.03,2.16 H2.1
$2N75: length 12.1
  Top Layer w0.6: v1(11.43,3.3) 13.67,3.3 13.68,3.31 14.25,3.31 U6.39
  Bottom Layer w0.6: v1(11.43,3.3) 11.26,3.13 6.55,3.13 5.83,2.41 H4.1
$2N76: length 11.6
  Top Layer w0.6: U6.38 v1(11.56,4.95)
  Bottom Layer w0.6: v1(11.56,4.95) 3.05,4.95 H4.2
$2N77: length 12.1
  Top Layer w0.6: v1(11.43,6.35) 11.56,6.22 U6.37
  Bottom Layer w0.6: v1(11.43,6.35) 4.19,6.35 H4.3
$2N78: length 12.6
  Top Layer w0.6: U6.36 11.31,7.49 v1(11.18,7.62)
  Bottom Layer w0.6: v1(11.18,7.62) 5.46,7.62 H4.4
$2N79: length 13.2
  Top Layer w0.6: U6.35 v1(11.68,8.76)
  Bottom Layer w0.6: H4.5 6.86,8.76 v1(11.68,8.76)
$2N80: length 13.7
  Top Layer w0.6: U6.34 v1(11.81,10.03)
  Bottom Layer w0.6: v1(11.81,10.03) 8.13,10.03 H4.6
$2N81: length 14.2
  Top Layer w0.6: U6.33 v1(11.94,11.3)
  Bottom Layer w0.6: H4.7 9.4,11.3 v1(11.94,11.3)
$2N82: length 15.1
  Top Layer w0.6: U6.32 14.36,12.83 11.56,12.83 v1(11.11,12.38)
  Bottom Layer w0.6: v1(11.11,12.38) 3.3,20.19 H4.8
$2N83: length 15.4
  Top Layer w0.6: U6.26 16.17,20.39 v1(14.67,20.39) ; v1(5.84,20.19) 5.59,20.19 H4.9
  Inner1 w0.6: 14.61,20.32 13.4,19.11 12.05,19.11 10.97,20.19 v1(5.84,20.19)
$2N84: length 26.4
  Top Layer w0.6: U6.25 17.65,18.53 v1(17.54,18.42)
  Inner2 w0.6: H4.10 1.8,26.52 1.8,28.33 2.53,29.06 4.79,29.06 13.4,20.46 13.4,19.5 14.48,18.42 v1(17.54,18.42)
$2N85: length 22.6
  Top Layer w0.6: v1(18.29,17.4) 18.92,18.03 U6.24
  Inner2 w0.6: H4.11 13.46,17.4 17.15,17.4 17.17,17.39 17.91,17.39 17.93,17.4 v1(18.29,17.4)
$2N86: length 25.5
  Top Layer w0.6: U6.23 v1(20.19,17.53)
  Inner2 w0.6: H4.12 7.37,30.35 11.92,25.79 11.92,25.15 12.45,24.62 13.09,24.62 v1(20.19,17.53)
$2N87: length 28
  Top Layer w0.6: U6.22 v1(21.46,17.91)
  Inner2 w0.6: H4.13 8.26,32.89 13.72,27.43 13.72,25.91 13.73,25.9 13.73,25.64 v1(21.46,17.91)
$2N88: length 37.8
  Top Layer w0.5: U6.17 27.39,20.62 27.39,21.11 27.11,21.4 15.71,21.4 15.65,21.46 v6(13.84,21.46)
  Inner2 w0.5: H4.14 4.89,33.59 8.55,33.59 12.55,29.59 14.26,29.59 15.62,28.23 15.62,25.02
  Bottom Layer w0.5: v6(15.68,24.96) 15.68,23.3 v6(13.84,21.46)
$2N89: length 41.6
  Top Layer w0.4: v1(32.89,21.46) 32.88,21.45 29.33,21.45 29.08,21.21 U6.16
  Inner2 w0.6: v1(32.89,21.46) 24.38,21.46 13.7,32.14 11.22,32.14 8.96,34.4 6.62,34.4 H4.15
$2N90: length 26.6
  Top Layer w0.4: U6.15 33.91,20.2 v1(34.42,20.7)
  Inner2 w0.4: v1(34.42,20.7) 34.42,20.95 39.02,25.55 39.02,29.09 46.86,36.94 H3.1
$2N91: length 26.1
  Top Layer w0.4: v1(34.92,17.4) 33.9,16.38 U6.12
  Inner2 w0.4: v1(34.92,17.4) 34.92,17.92 39.57,22.56 39.57,28.01 H3.2
$2N92: length 30.3
  Top Layer w0.4: U6.8 32.21,11.39 36.83,11.39 38.23,12.79 v1(38.23,14.1)
  Inner2 w0.4: v1(38.23,14.1) 41.27,17.14 41.27,27.18 H3.3
$2N93: length 45.2
  Top Layer w0.6: U6.7 31.17,10.03 30.87,10.32 30.87,10.67 30.35,11.2 29.6,11.2 29.07,10.67 29.07,6.98 27.93,5.84 v1(26.42,5.84)
  Inner1 w0.6: v1(26.42,5.84) 26.42,10.03 33.02,16.64 34.41,16.64 34.55,16.5 35.3,16.5 35.44,16.64 35.56,16.64 38.65,19.72 38.65,21.24 46.86,29.46 H3.4
$2N94: length 27.8
  Top Layer w0.6: 29.97,10.16 31.37,8.76 U6.6
  Inner1 w0.6: 46.86,27.69 46.86,26.92 40.89,20.95 40.89,20.07 31.13,10.3 v1(29.97,10.3)

## Copper pours and planes (outline as drawn; the poured copper is in the pictures)
+3V3 on Top Layer: 21.59,63.63 27.81,63.63 27.81,59.94 21.59,59.94
GND on Top Layer: 6.83,64.25 11.71,64.25 11.71,63 6.83,63
GND on Top Layer: 20.45,75.65 24.51,75.65 24.51,71.25 20.45,71.25
GND on Top Layer: 31.75,79.12 39.57,79.12 39.57,75.18 31.75,75.18
GND on Top Layer: 16.51,69.09 19.56,69.09 19.56,67.82 16.51,67.82
GND on Top Layer: 27.48,59.99 28.93,59.99 28.93,56.69 27.48,56.69
GND on Top Layer: 16.64,66.55 19.56,66.55 19.56,65.37 16.64,65.37
GND on Top Layer: 11.11,72.46 19.37,72.46 19.37,71.58 11.11,71.58
GND on Top Layer: 10.29,76.33 14.64,76.33 14.64,74.52 10.29,74.52
GND on Top Layer: 14.69,66.55 17.78,66.55 17.78,65.79 14.69,65.79
GND on Top Layer: 45.85,70.36 48.13,70.36 48.13,66.29 45.85,66.29
GND on Top Layer: 26.04,57.66 28.93,57.66 28.93,56.75 26.04,56.75
GND on Top Layer: 22.99,12.06 26.8,12.06 26.8,8.25 22.99,8.25
GND on Top Layer: 46.36,46.1 48.01,46.1 48.01,42.42 46.36,42.42
GND on Top Layer: 10.8,71.73 11.91,71.73 11.91,68.97 10.8,68.97
GND on Top Layer: 10.29,76.36 12.07,76.36 12.07,70.79 10.29,70.79
GND on Top Layer: 23.62,72.14 25.36,72.14 25.36,71.28 23.62,71.28
GND on Inner1: 0.02,81.79 49.15,81.79 49.15,0 0.02,0
VBAT on Top Layer: 4.45,48.59 17.91,48.59 17.91,43.94 4.45,43.94
VBAT on Top Layer: 3.68,62.74 9.91,62.74 9.91,60.45 3.68,60.45
VBAT on Top Layer: 29.4,52.4 33.2,52.4 33.2,51.24 29.4,51.24
VBAT on Top Layer: 13.46,28.19 15.11,28.19 15.11,26.29 13.46,26.29
MIC_P on Top Layer: 38.63,69.02 41.27,69.02 41.27,68.1 38.63,68.1
$1N4 on Top Layer: 9.78,71.75 10.41,71.75 10.41,68.96 9.78,68.96
$1N8 on Top Layer: 10.8,67.18 11.33,67.18 11.33,64.73 10.8,64.73
$1N10 on Top Layer: 14.66,68.12 17.75,68.12 17.75,67.25 14.66,67.25
$1N12 on Top Layer: 17.65,69.27 23.05,69.27 23.05,64.34 17.65,64.34
$1N12 on Top Layer: 19.68,75.1 25.35,75.1 25.35,69.91 19.68,69.91
$1N12 on Top Layer: 22.38,70.1 24.3,70.1 24.3,68.45 22.38,68.45
$1N12 on Top Layer: 24.46,72.14 29.72,72.14 29.72,69.85 24.46,69.85

Small or netless copper shapes (teardrops, artwork), in the pictures only: 2 on Top Layer

## Text on the board
Top Silkscreen Layer: DEV BY ARYAN-GIT-BYTE
